# Altium project demo_dermis_main_testboard.PrjPcb (part 1 of 2)
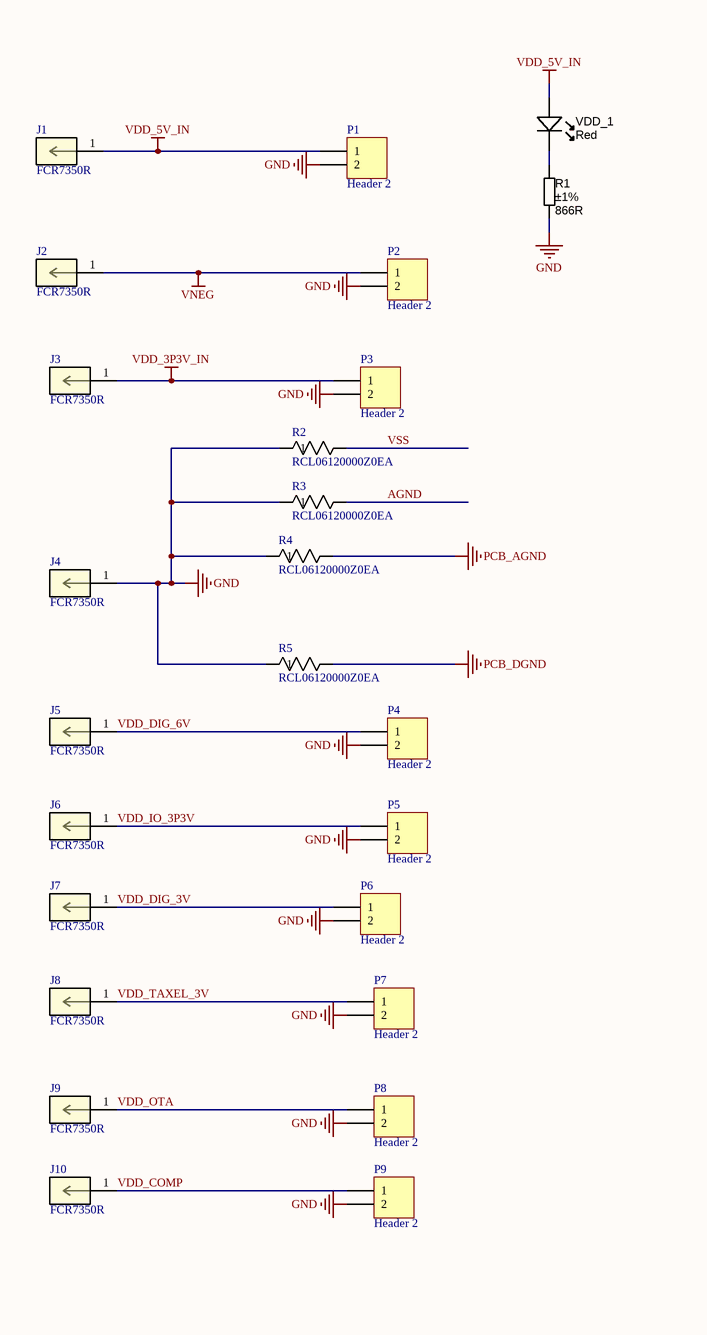
[diagram p0: demo_dermis_main_testboard.SchDoc, top left]
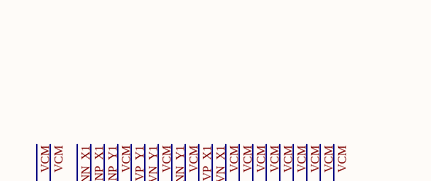
[diagram p1: demo_dermis_main_testboard.SchDoc, top right]
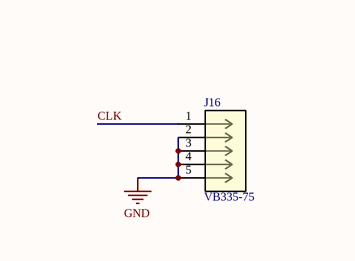
[diagram p2: demo_dermis_main_testboard.SchDoc, bottom middle]
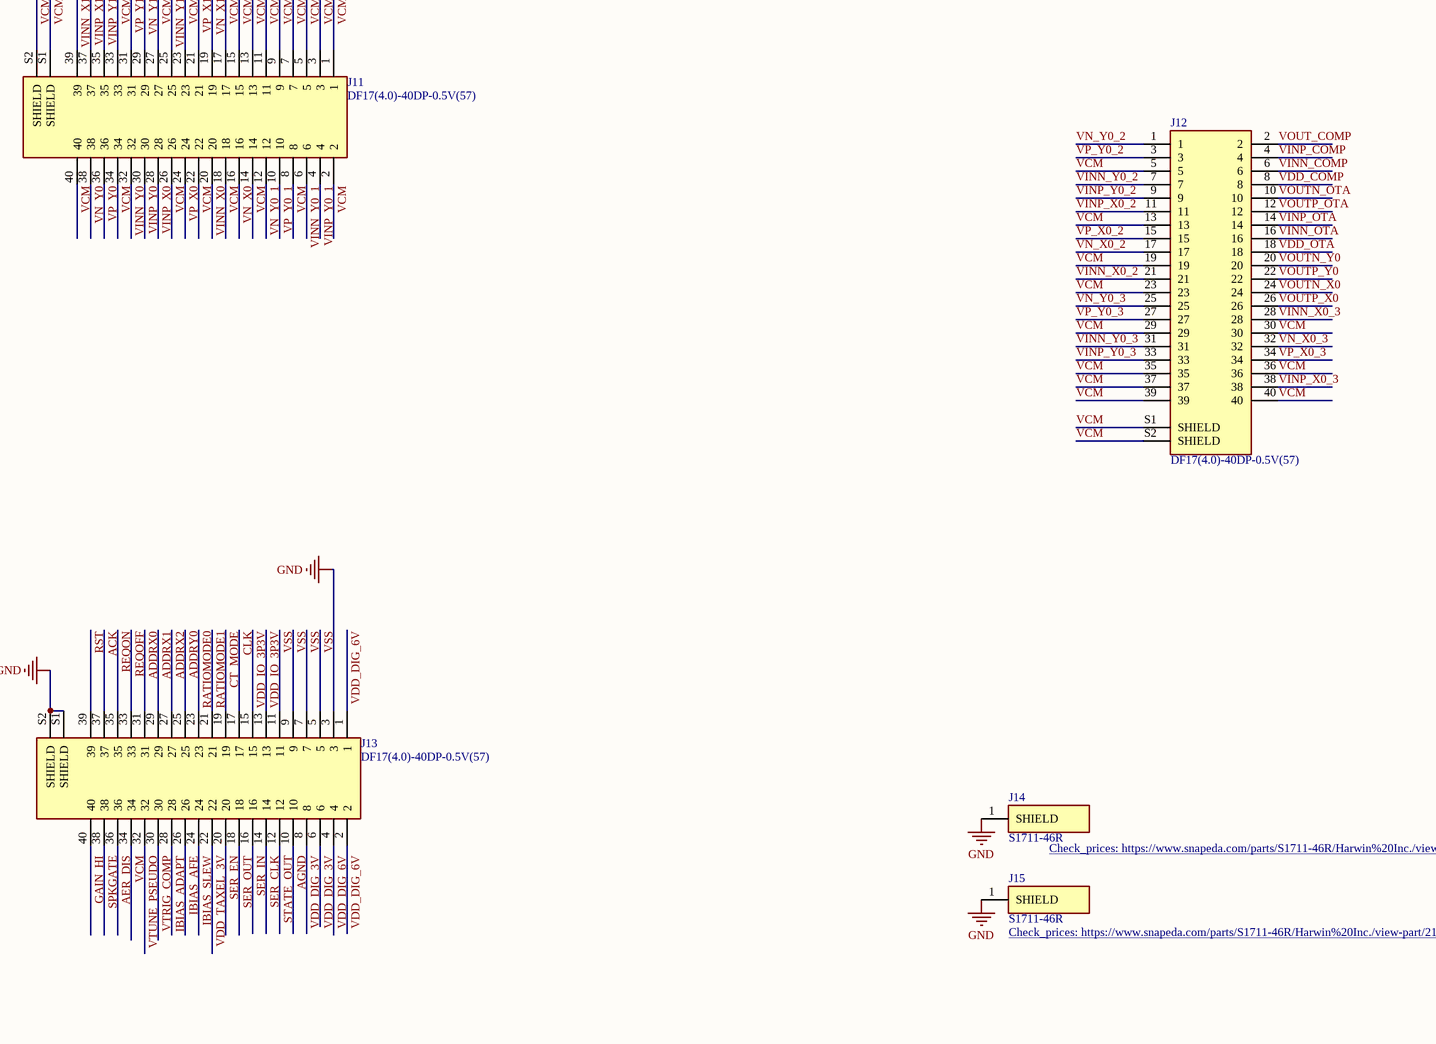
[diagram p3: demo_dermis_main_testboard.SchDoc, bottom right]
6 sheets, 389 parts. Net scope: global (net labels, ports and power ports of the same name join across sheets).
Board file: demo_dermis_main_testboard.PcbDoc
Sheets:
  demo_dermis_main_testboard.SchDoc
  demo_dermis_main_testboard_ncd2400.SchDoc
  demo_dermis_main_testboard_ibias.SchDoc
  demo_dermis_main_testboard_inamps.SchDoc
  demo_dermis_main_testboard_dig.SchDoc
  demo_dermis_main_testboard_back.SchDoc

## Sheet demo_dermis_main_testboard.SchDoc
size A0

### Parts
J1  FCR7350R  [CONN1_FCR7350R_CLF]
J2  FCR7350R  [CONN1_FCR7350R_CLF]
J3  FCR7350R  [CONN1_FCR7350R_CLF]
J4  FCR7350R  [CONN1_FCR7350R_CLF]
J5  FCR7350R  [CONN1_FCR7350R_CLF]
J6  FCR7350R  [CONN1_FCR7350R_CLF]
J7  FCR7350R  [CONN1_FCR7350R_CLF]
J8  FCR7350R  [CONN1_FCR7350R_CLF]
J9  FCR7350R  [CONN1_FCR7350R_CLF]
J10  FCR7350R  [CONN1_FCR7350R_CLF]
J11  DF17(4.0)-40DP-0.5V(57)  [HRS_DF17(4.0)-40DP-0.5V(57)]
J12  DF17(4.0)-40DP-0.5V(57)  [HRS_DF17(4.0)-40DP-0.5V(57)]
J13  DF17(4.0)-40DP-0.5V(57)  [HRS_DF17(4.0)-40DP-0.5V(57)]
J14  S1711-46R  [HARWIN_S1711-46R]
J15  S1711-46R  [HARWIN_S1711-46R]
J16  VB335-75  [CONN5_VB335_CIN]
P1  Header 2  [HDR1X2]
P2  Header 2  [HDR1X2]
P3  Header 2  [HDR1X2]
P4  Header 2  [HDR1X2]
P5  Header 2  [HDR1X2]
P6  Header 2  [HDR1X2]
P7  Header 2  [HDR1X2]
P8  Header 2  [HDR1X2]
P9  Header 2  [HDR1X2]
R1  value 866R  Tolerance: ±1%  [RESC1608N]  (hidden comment: Thick Film)
R2  RCL06120000Z0EA  [RCL0612_VIS]
R3  RCL06120000Z0EA  [RCL0612_VIS]
R4  RCL06120000Z0EA  [RCL0612_VIS]
R5  RCL06120000Z0EA  [RCL0612_VIS]
VDD_1  Red  [LED-0603-RED]

### Nets
AGND: J13.10 R3.2
GND: J4.1 J13.3 J13.S1(SHIELD) J13.S2(SHIELD) J14.1(SHIELD) J15.1(SHIELD) J16.2 J16.3 J16.4 J16.5 P1.2 P2.2 P3.2 P4.2 P5.2 P6.2 P7.2 P8.2 P9.2 R1.2 R2.1 R3.1 R4.1 R5.1
PCB_AGND: R4.2
PCB_DGND: R5.2
VDD_3P3V_IN: J3.1 P3.1
VDD_5V_IN: J1.1 P1.1 VDD_1.A
VNEG: J2.1 P2.1
ACK: J13.37
ADDRX0: J13.31
ADDRX1: J13.29
ADDRX2: J13.27
ADDRY0: J13.25
AER_DIS: J13.36
CLK: J13.17 J16.1
CT_MODE: J13.19
GAIN_HI: J13.40
IBIAS_ADAPT: J13.28
IBIAS_AFE: J13.26
IBIAS_SLEW: J13.24
RATIOMODE0: J13.23
RATIOMODE1: J13.21
REQOFF: J13.33
REQON: J13.35
RST: J13.39
SER_CLK: J13.14
SER_EN: J13.20
SER_IN: J13.16
SER_OUT: J13.18
SPKGATE: J13.38
STATE_OUT: J13.12
VCM: J11.1 J11.2 J11.3 J11.5 J11.7 J11.8 J11.9 J11.11 J11.13 J11.14 J11.15 J11.17 J11.18 J11.22 J11.23 J11.26 J11.27 J11.33 J11.34 J11.40 J11.S1(SHIELD) J11.S2(SHIELD) J12.5 J12.13 J12.19 J12.23 J12.29 J12.30 J12.35 J12.36 J12.37 J12.39 J12.40 J12.S1(SHIELD) J12.S2(SHIELD) J13.34
VDD_COMP: J10.1 J12.8 P9.1
VDD_DIG_3V: J7.1 J13.6 J13.8 P6.1
VDD_DIG_6V: J5.1 J13.1 J13.2 J13.4 P4.1
VDD_IO_3P3V: J6.1 J13.13 J13.15 P5.1
VDD_OTA: J9.1 J12.18 P8.1
VDD_TAXEL_3V: J8.1 J13.22 P7.1
VINN_COMP: J12.6
VINN_OTA: J12.16
VINN_X0: J11.20
VINN_X0_2: J12.21
VINN_X0_3: J12.28
VINN_X1: J11.39
VINN_Y0: J11.32
VINN_Y0_1: J11.6
VINN_Y0_2: J12.7
VINN_Y0_3: J12.31
VINN_Y1: J11.25
VINP_COMP: J12.4
VINP_OTA: J12.14
VINP_X0: J11.28
VINP_X0_2: J12.11
VINP_X0_3: J12.38
VINP_X1: J11.37
VINP_Y0: J11.30
VINP_Y0_1: J11.4
VINP_Y0_2: J12.9
VINP_Y0_3: J12.33
VINP_Y1: J11.35
VN_X0: J11.16
VN_X0_2: J12.17
VN_X0_3: J12.32
VN_X1: J11.19
VN_Y0: J11.38
VN_Y0_1: J11.12
VN_Y0_2: J12.1
VN_Y0_3: J12.25
VN_Y1: J11.29
VOUT_COMP: J12.2
VOUTN_OTA: J12.10
VOUTN_X0: J12.24
VOUTN_Y0: J12.20
VOUTP_OTA: J12.12
VOUTP_X0: J12.26
VOUTP_Y0: J12.22
VP_X0: J11.24
VP_X0_2: J12.15
VP_X0_3: J12.34
VP_X1: J11.21
VP_Y0: J11.36
VP_Y0_1: J11.10
VP_Y0_2: J12.3
VP_Y0_3: J12.27
VP_Y1: J11.31
VSS: J13.5 J13.7 J13.9 J13.11 R2.2
VTRIG_COMP: J13.30
VTUNE_PSEUDO: J13.32
NetR1_1: R1.1 VDD_1.K

### Notes on the sheet
- Title
- Size:
- Date:
- File:
- A0
- Number:
- Time:
- Revision:
- Sheet
- of

### Library data of the parts
J1-J10 = FCR7350R: No Description Available; Mfr_Name: Cliff; Copyright: Copyright (C) 2022 Ultra Librarian. All rights reserved.; Manufacturer_Part_Number: FCR7350R; RefDes: RefDes; Type: DEV
J11-J13 = DF17(4.0)-40DP-0.5V(57): PC Board, Headers & Receptacles, hdr, fit, series, mount, pos, Connectors and Adapters, connector, header, Connectors...; Availability: Unavailable; MP: DF17(4.0)-40DP-0.5V(57); Price: None; Package: None; Value: *
J14 J15 = S1711-46R: RFI SHIELD CLIP TIN SMD; MF: Harwin Inc.; Purchase-URL: https://pricing.snapeda.com/search/part/S1711-46R/?ref=eda; MP: S1711-46R; SnapEDA_Link: https://www.snapeda.com/parts/S1711-46R/Harwin%20Inc./view-part/2172610/?ref=snap; Price: None; Package: None; Value: *; Availability: Warning; Check_prices: https://www.snapeda.com/parts/S1711-46R/Harwin%20Inc./view-part/2172610/?ref=eda
J16 = VB335-75: No Description Available; Mfr_Name: Cinch Connectivity Solutions; Type: Coaxial Connectors(RF) Assemblies; RefDes: RefDes
P1-P9 = Header 2: Header, 2-Pin; LatestRevisionDate: 17-Jul-2002; LatestRevisionNote: Re-released for DXP Platform.; Publisher: Altium Limited
R1 = RES_866R_0603_1%_1: Resistor SMD chip 866 Ohm 0.1W 1% 0603; Ratings: 1/10W; Package / Case: 0603 (1608 Metric)
R2-R5 = RCL06120000Z0EA: No Description Available; Mfr_Name: Vishay
VDD_1 = LED_SMD_Red_0603_220mcd: LED 0603 SMD Hyper Red 630nm 220mcd 20mA; Manufacturer 1: Kingbright Corp; Manufacturer Part Number 1: APT1608SURCK; Ratings: 220 mcd; 630 nm; Voltage - Forward (Vf) Typ: 1.95V; Voltage - Forward (Vf) @ 10mA: 1.9V; Package / Case: 0603 (1608 metric); Material: AlGaInP on GaAs; Supplier 1: Digi-Key; Supplier Part Number 1: 754-1123-1-ND

## Sheet demo_dermis_main_testboard_ncd2400.SchDoc
size E
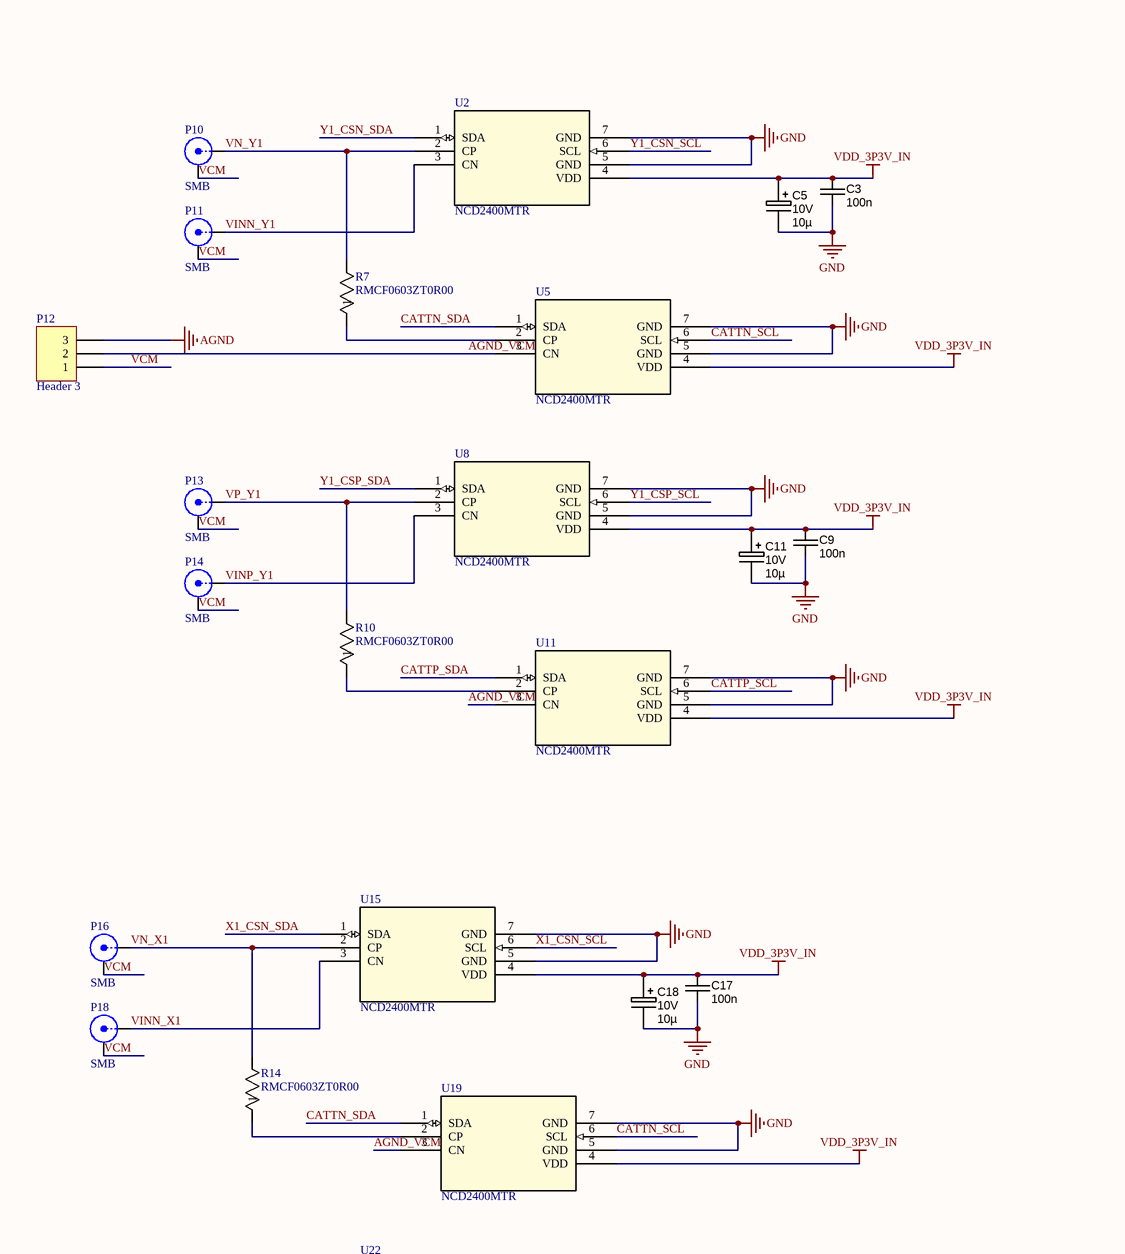
[diagram p4: demo_dermis_main_testboard_ncd2400.SchDoc, top left]
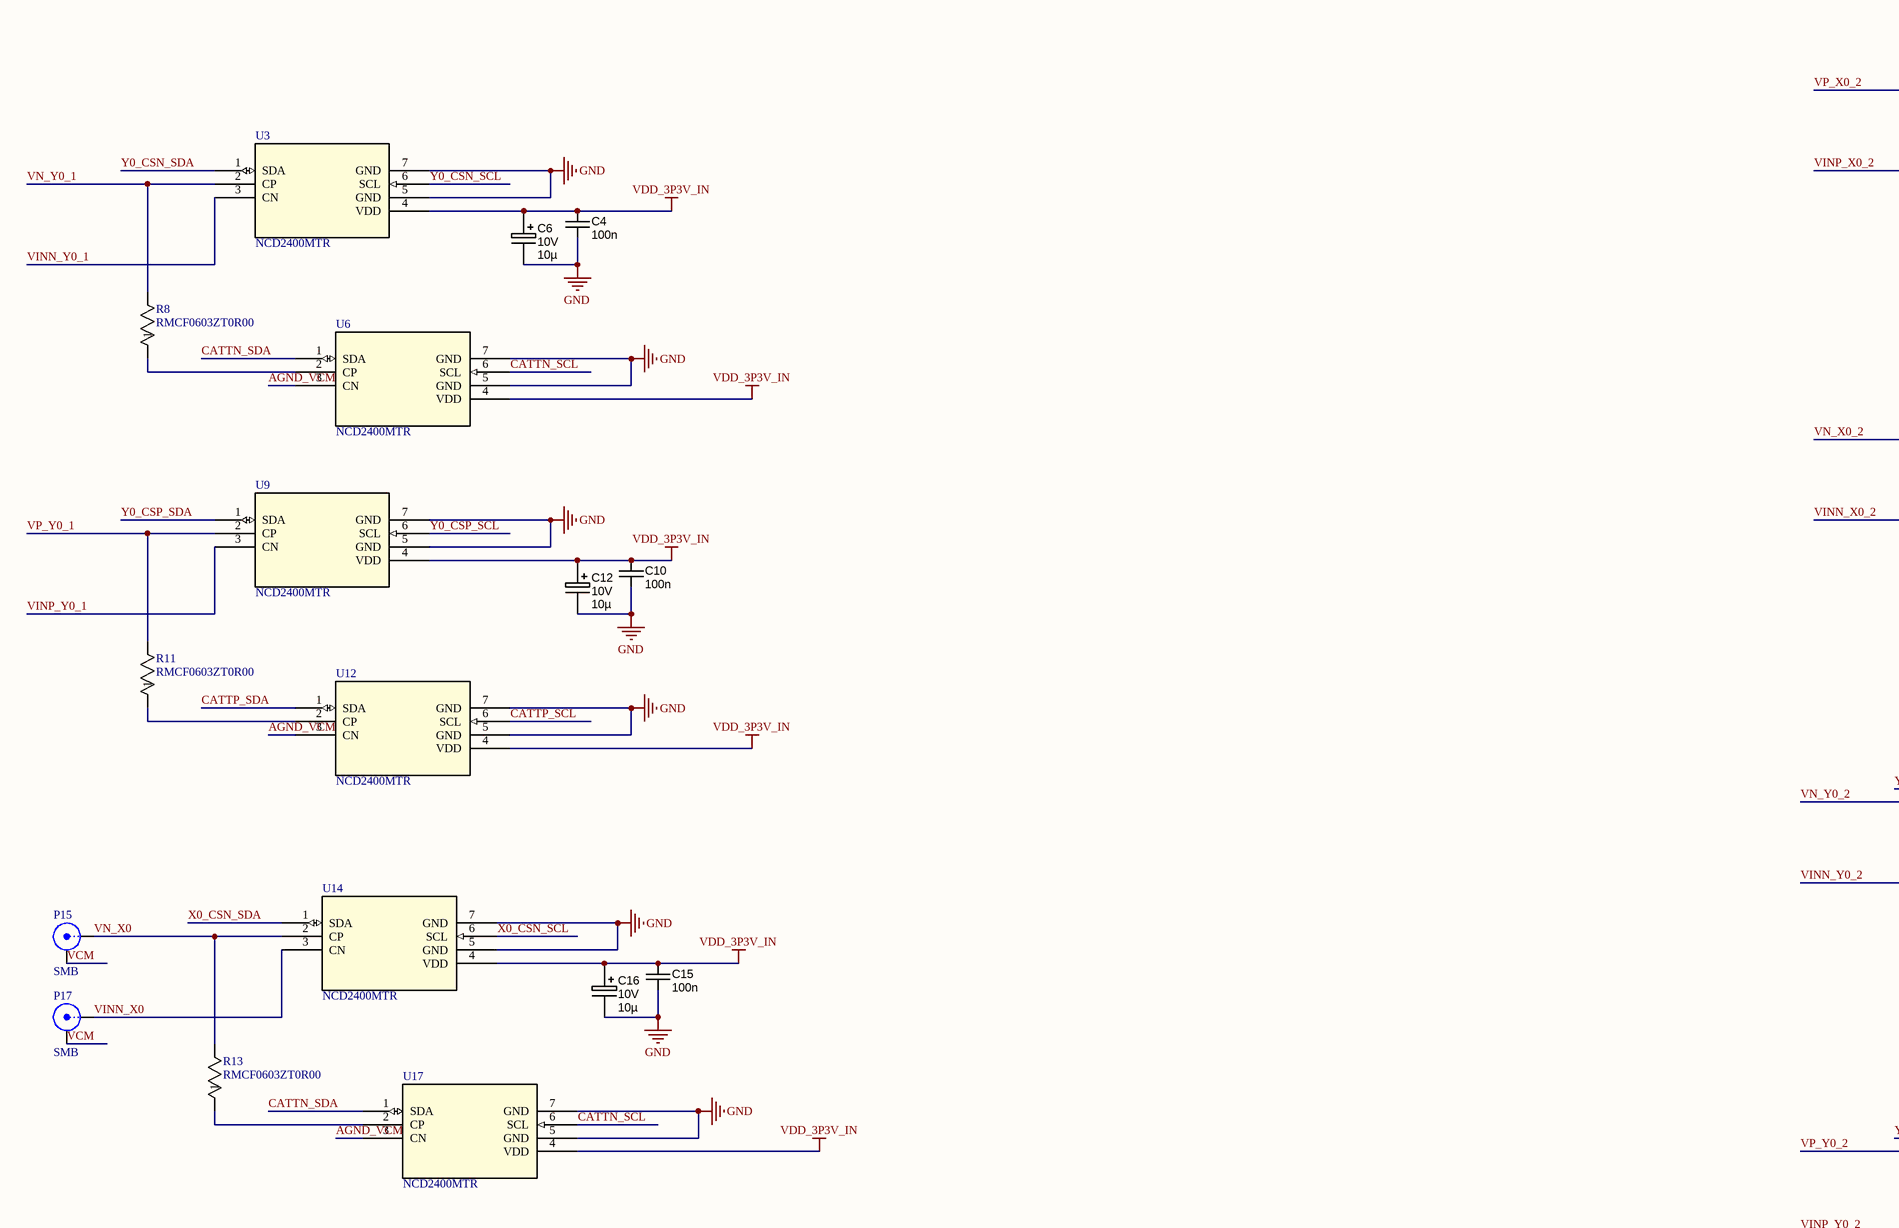
[diagram p5: demo_dermis_main_testboard_ncd2400.SchDoc, top middle]
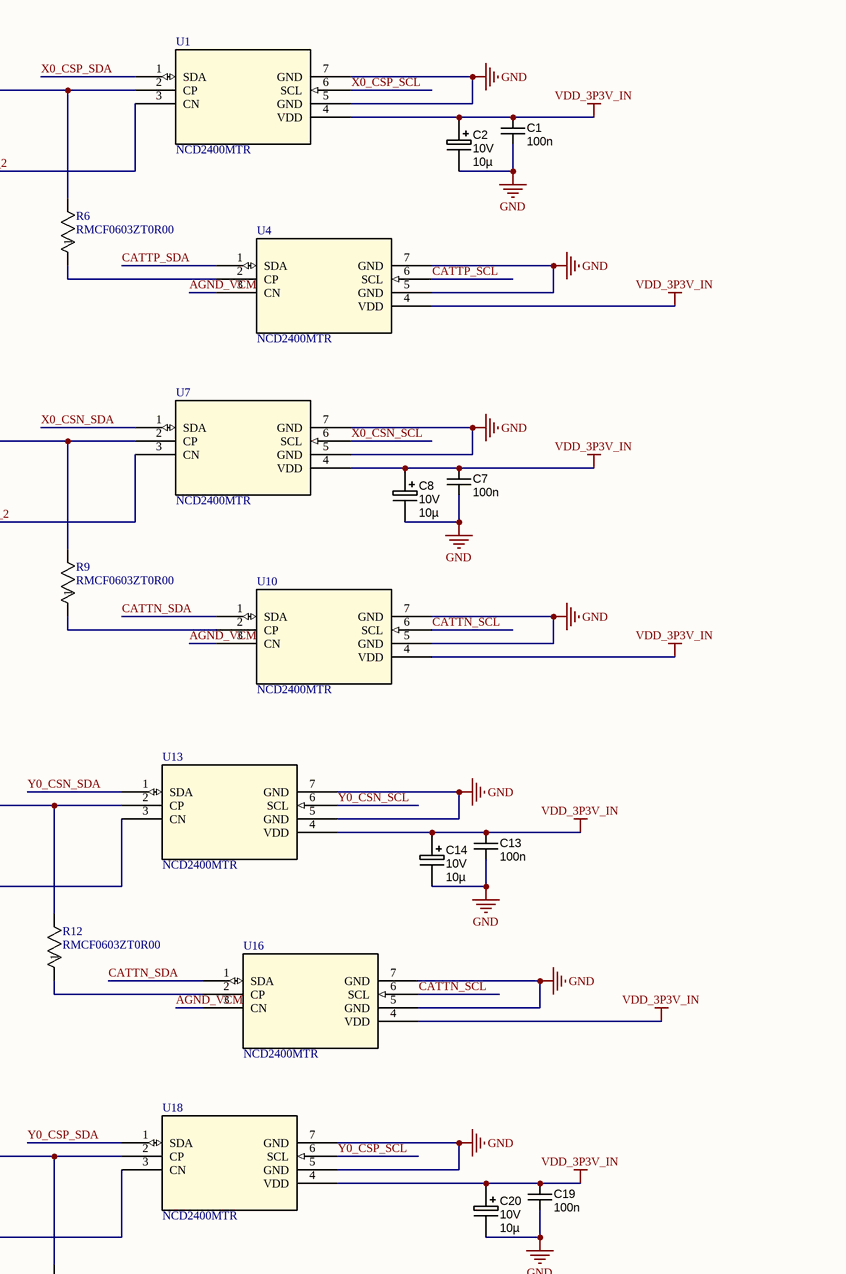
[diagram p6: demo_dermis_main_testboard_ncd2400.SchDoc, top right]
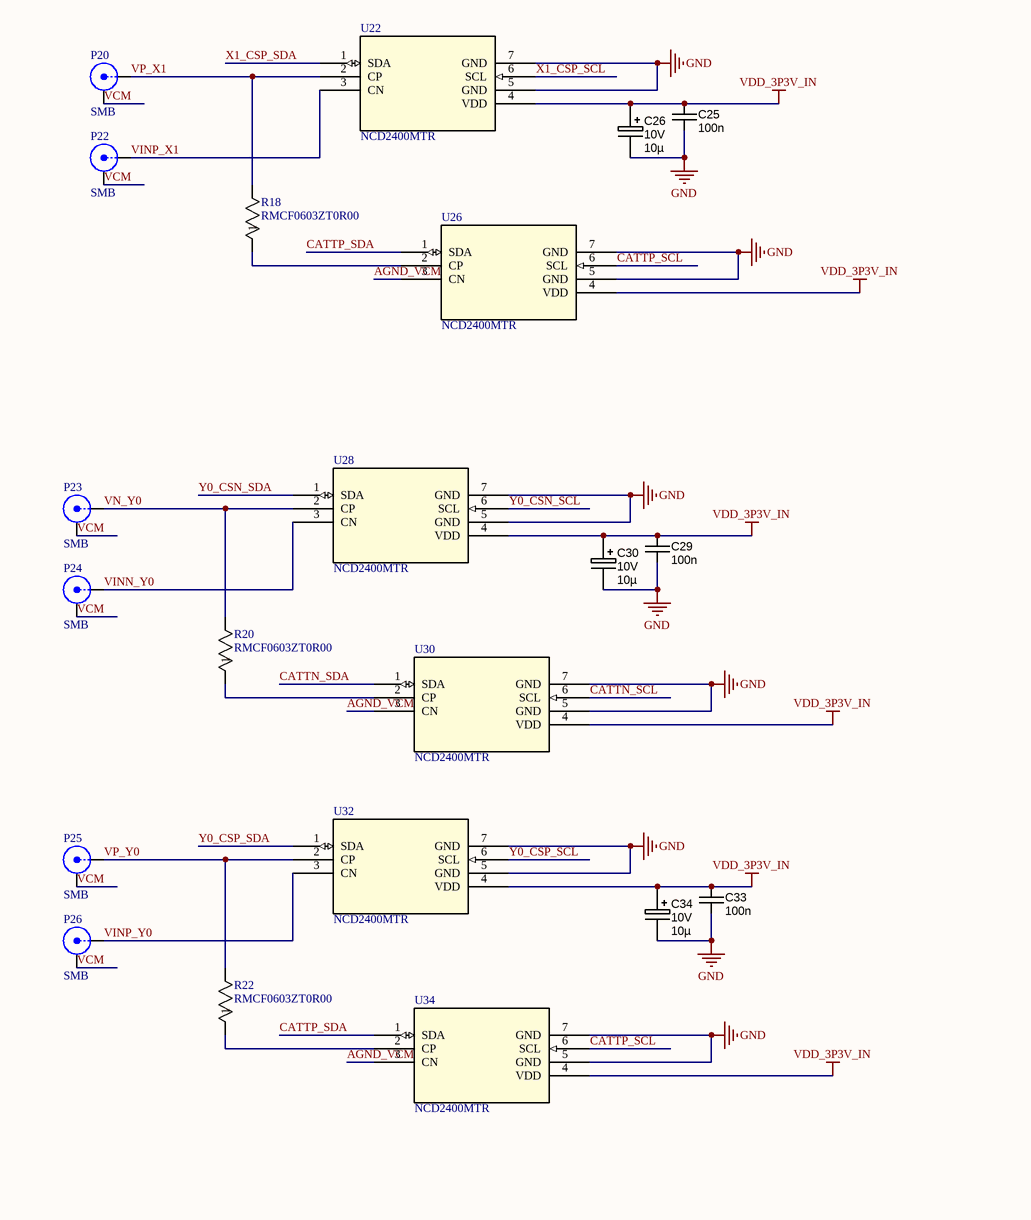
[diagram p7: demo_dermis_main_testboard_ncd2400.SchDoc, bottom left]
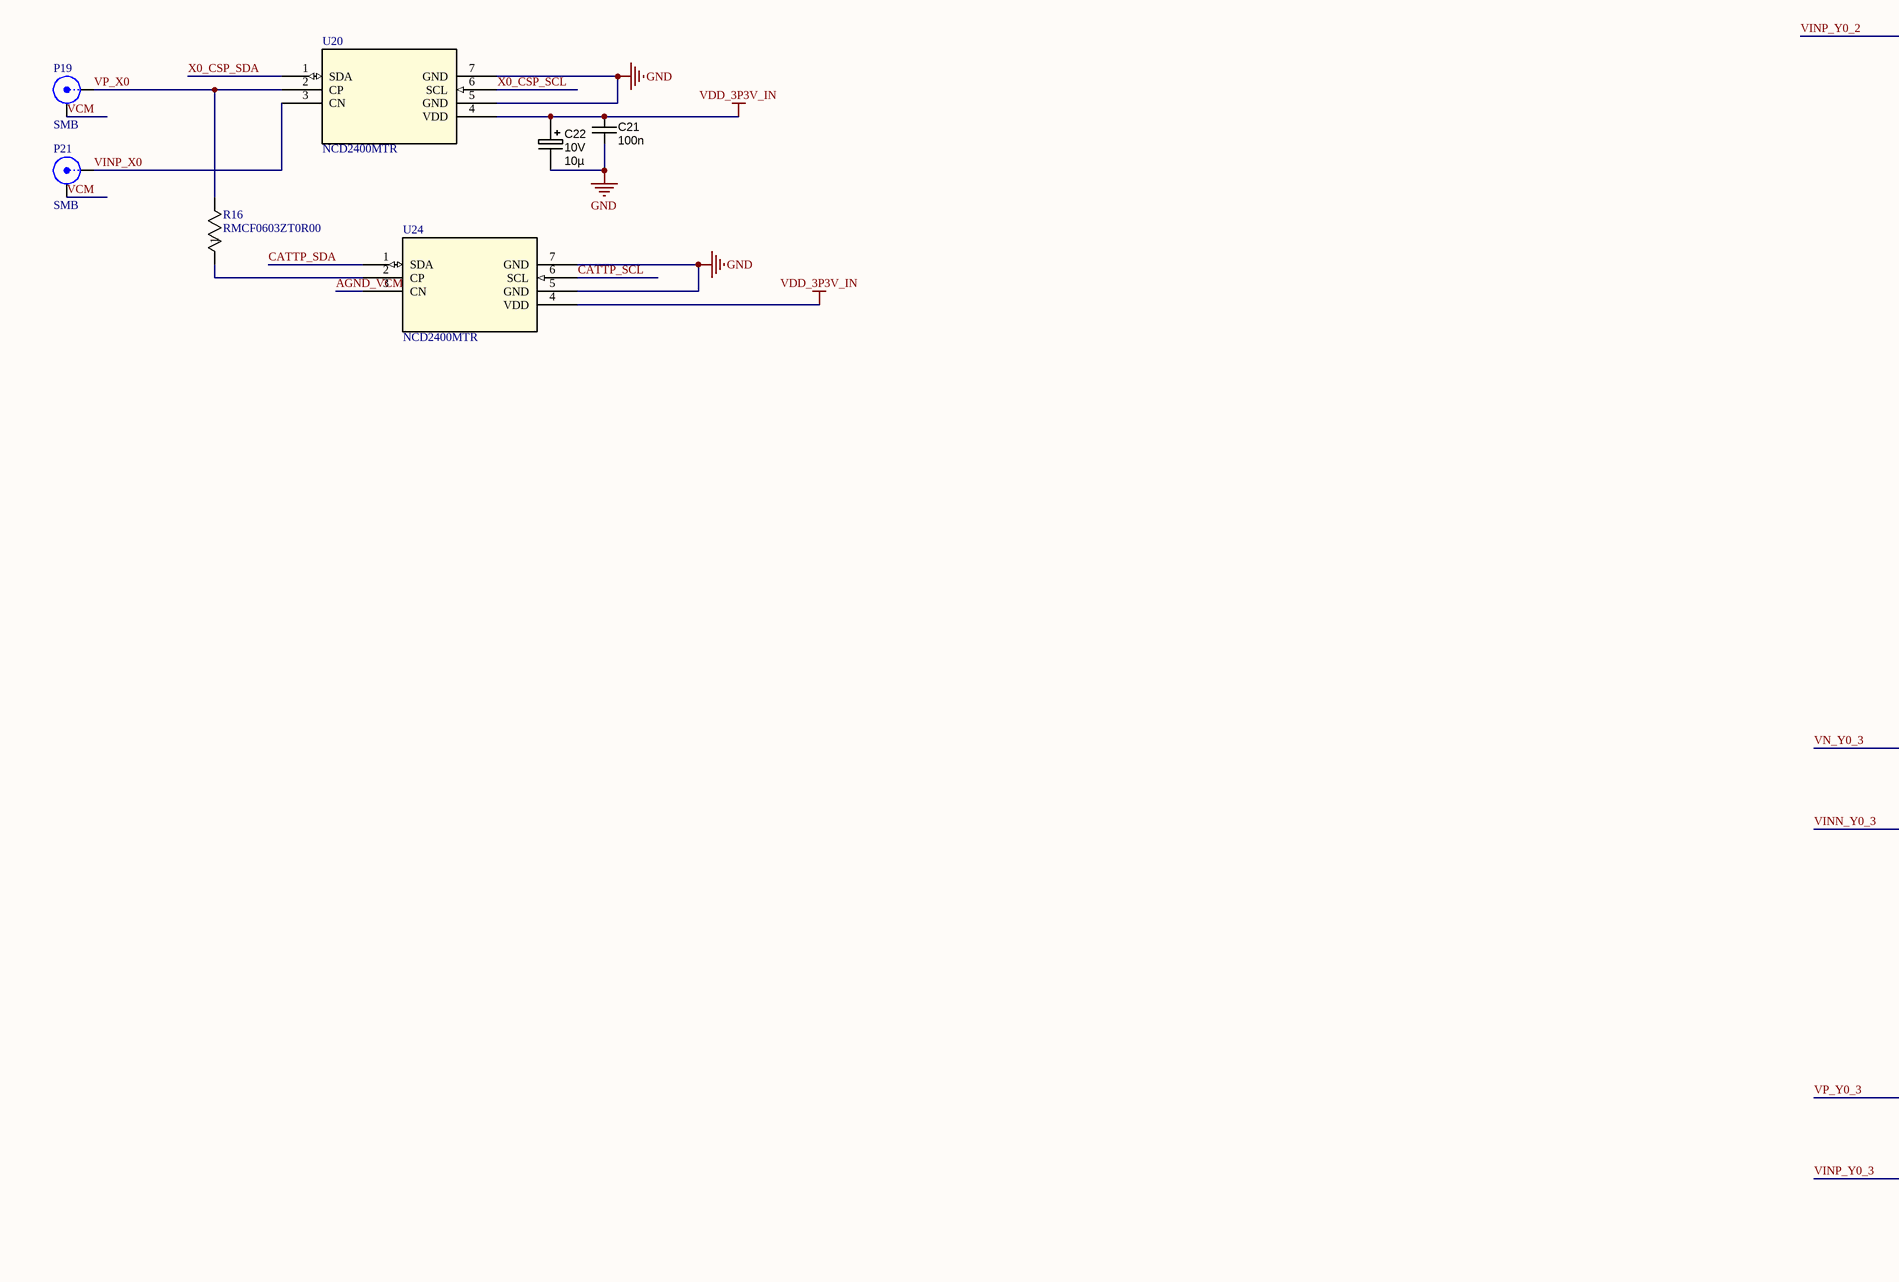
[diagram p8: demo_dermis_main_testboard_ncd2400.SchDoc, bottom middle]
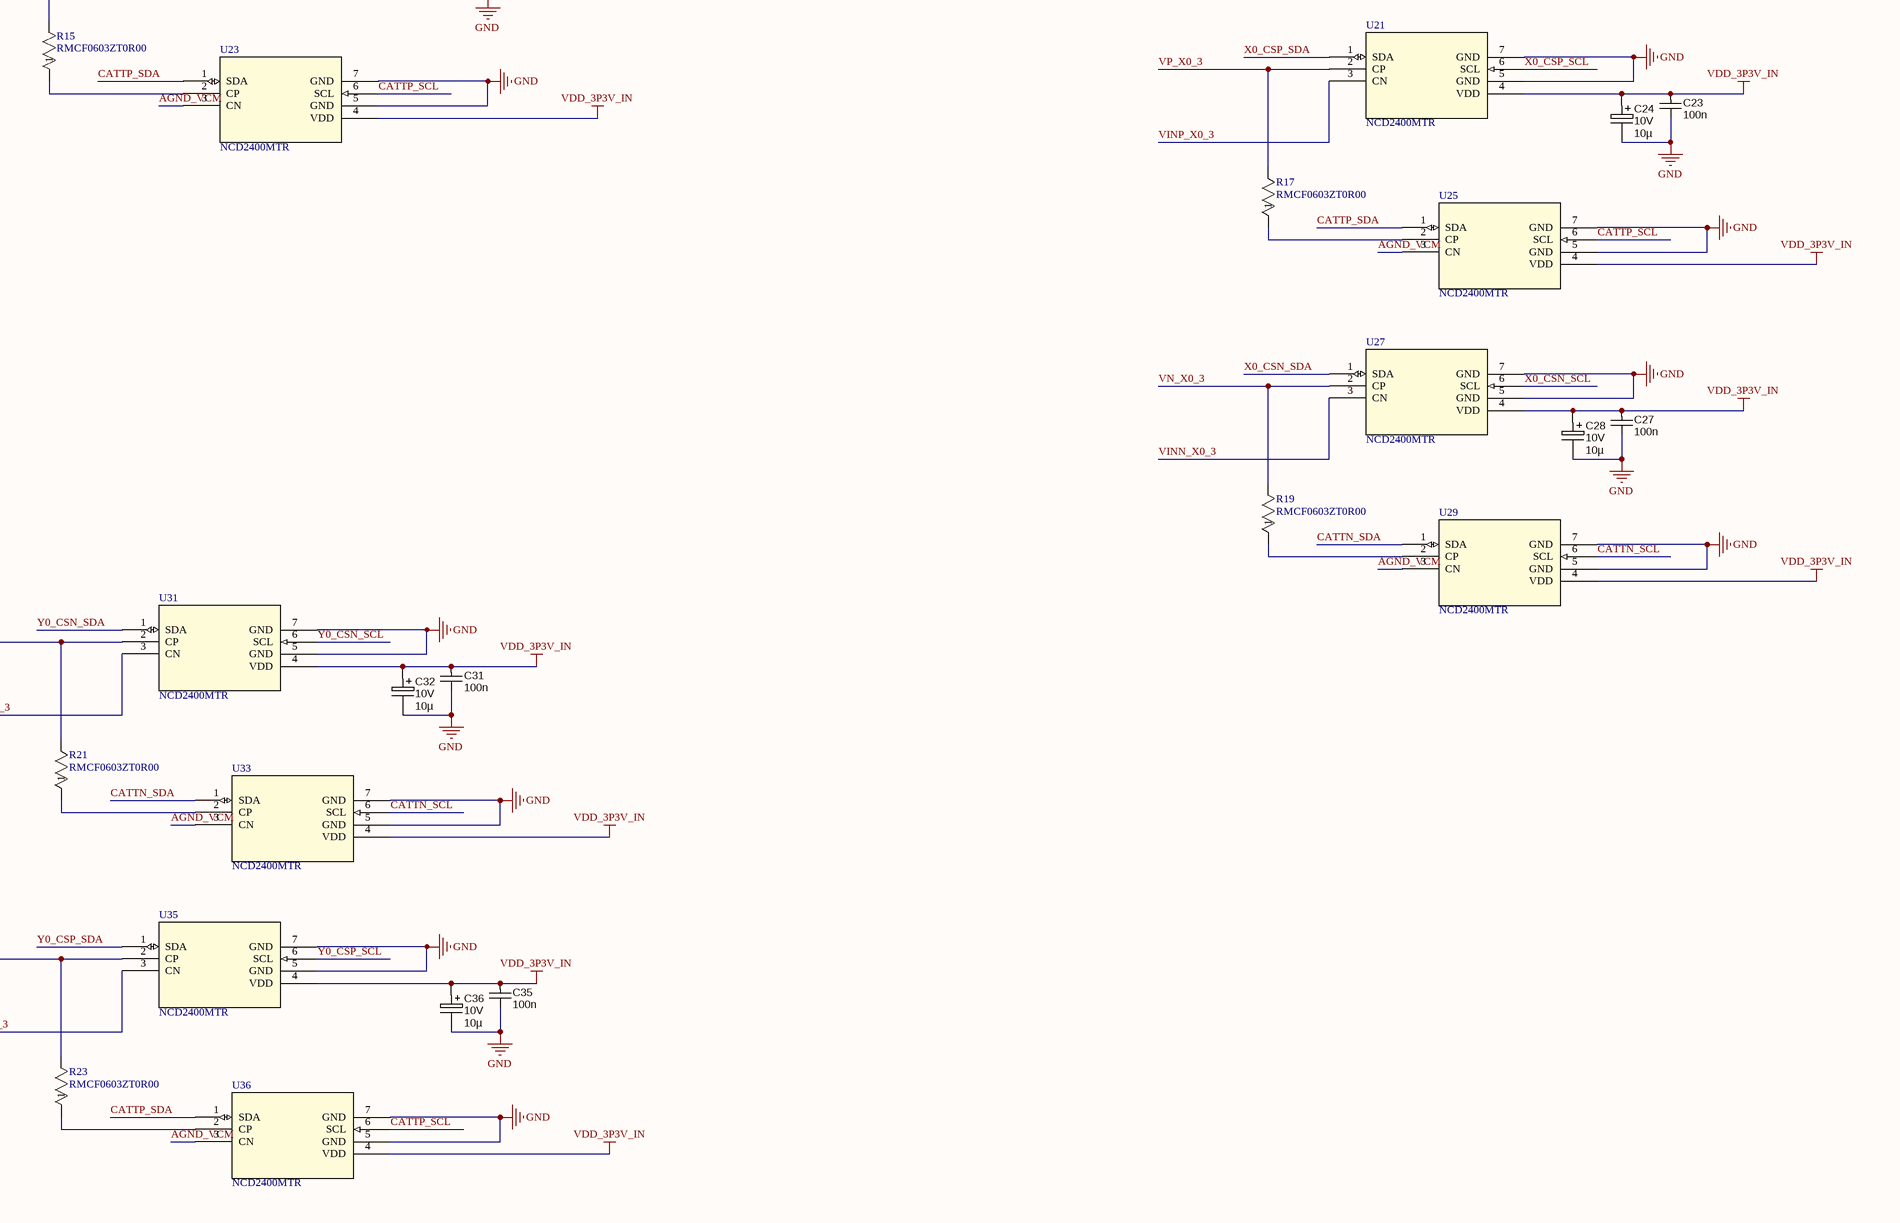
[diagram p9: demo_dermis_main_testboard_ncd2400.SchDoc, bottom right]

### Parts
C1  value 100n  [CAPC1608N]  (hidden comment: approved sub OK)
C2  Ratings: 10V  [CAPMP2012X150USR]  (hidden comment: 10µ)
C3  value 100n  [CAPC1608N]  (hidden comment: approved sub OK)
C4  value 100n  [CAPC1608N]  (hidden comment: approved sub OK)
C5  Ratings: 10V  [CAPMP2012X150USR]  (hidden comment: 10µ)
C6  Ratings: 10V  [CAPMP2012X150USR]  (hidden comment: 10µ)
C7  value 100n  [CAPC1608N]  (hidden comment: approved sub OK)
C8  Ratings: 10V  [CAPMP2012X150USR]  (hidden comment: 10µ)
C9  value 100n  [CAPC1608N]  (hidden comment: approved sub OK)
C10  value 100n  [CAPC1608N]  (hidden comment: approved sub OK)
C11  Ratings: 10V  [CAPMP2012X150USR]  (hidden comment: 10µ)
C12  Ratings: 10V  [CAPMP2012X150USR]  (hidden comment: 10µ)
C13  value 100n  [CAPC1608N]  (hidden comment: approved sub OK)
C14  Ratings: 10V  [CAPMP2012X150USR]  (hidden comment: 10µ)
C15  value 100n  [CAPC1608N]  (hidden comment: approved sub OK)
C16  Ratings: 10V  [CAPMP2012X150USR]  (hidden comment: 10µ)
C17  value 100n  [CAPC1608N]  (hidden comment: approved sub OK)
C18  Ratings: 10V  [CAPMP2012X150USR]  (hidden comment: 10µ)
C19  value 100n  [CAPC1608N]  (hidden comment: approved sub OK)
C20  Ratings: 10V  [CAPMP2012X150USR]  (hidden comment: 10µ)
C21  value 100n  [CAPC1608N]  (hidden comment: approved sub OK)
C22  Ratings: 10V  [CAPMP2012X150USR]  (hidden comment: 10µ)
C23  value 100n  [CAPC1608N]  (hidden comment: approved sub OK)
C24  Ratings: 10V  [CAPMP2012X150USR]  (hidden comment: 10µ)
C25  value 100n  [CAPC1608N]  (hidden comment: approved sub OK)
C26  Ratings: 10V  [CAPMP2012X150USR]  (hidden comment: 10µ)
C27  value 100n  [CAPC1608N]  (hidden comment: approved sub OK)
C28  Ratings: 10V  [CAPMP2012X150USR]  (hidden comment: 10µ)
C29  value 100n  [CAPC1608N]  (hidden comment: approved sub OK)
C30  Ratings: 10V  [CAPMP2012X150USR]  (hidden comment: 10µ)
C31  value 100n  [CAPC1608N]  (hidden comment: approved sub OK)
C32  Ratings: 10V  [CAPMP2012X150USR]  (hidden comment: 10µ)
C33  value 100n  [CAPC1608N]  (hidden comment: approved sub OK)
C34  Ratings: 10V  [CAPMP2012X150USR]  (hidden comment: 10µ)
C35  value 100n  [CAPC1608N]  (hidden comment: approved sub OK)
C36  Ratings: 10V  [CAPMP2012X150USR]  (hidden comment: 10µ)
P10  SMB  [SMB_V-RJ45]
P11  SMB  [SMB_V-RJ45]
P12  Header 3  [HDR1X3]
P13  SMB  [SMB_V-RJ45]
P14  SMB  [SMB_V-RJ45]
P15  SMB  [SMB_V-RJ45]
P16  SMB  [SMB_V-RJ45]
P17  SMB  [SMB_V-RJ45]
P18  SMB  [SMB_V-RJ45]
P19  SMB  [SMB_V-RJ45]
P20  SMB  [SMB_V-RJ45]
P21  SMB  [SMB_V-RJ45]
P22  SMB  [SMB_V-RJ45]
P23  SMB  [SMB_V-RJ45]
P24  SMB  [SMB_V-RJ45]
P25  SMB  [SMB_V-RJ45]
P26  SMB  [SMB_V-RJ45]
R6  RMCF0603ZT0R00  [STA_RMCF0603_STP]
R7  RMCF0603ZT0R00  [STA_RMCF0603_STP]
R8  RMCF0603ZT0R00  [STA_RMCF0603_STP]
R9  RMCF0603ZT0R00  [STA_RMCF0603_STP]
R10  RMCF0603ZT0R00  [STA_RMCF0603_STP]
R11  RMCF0603ZT0R00  [STA_RMCF0603_STP]
R12  RMCF0603ZT0R00  [STA_RMCF0603_STP]
R13  RMCF0603ZT0R00  [STA_RMCF0603_STP]
R14  RMCF0603ZT0R00  [STA_RMCF0603_STP]
R15  RMCF0603ZT0R00  [STA_RMCF0603_STP]
R16  RMCF0603ZT0R00  [STA_RMCF0603_STP]
R17  RMCF0603ZT0R00  [STA_RMCF0603_STP]
R18  RMCF0603ZT0R00  [STA_RMCF0603_STP]
R19  RMCF0603ZT0R00  [STA_RMCF0603_STP]
R20  RMCF0603ZT0R00  [STA_RMCF0603_STP]
R21  RMCF0603ZT0R00  [STA_RMCF0603_STP]
R22  RMCF0603ZT0R00  [STA_RMCF0603_STP]
R23  RMCF0603ZT0R00  [STA_RMCF0603_STP]
U1  NCD2400MTR  [DFN-6_IXY]
U2  NCD2400MTR  [DFN-6_IXY]
U3  NCD2400MTR  [DFN-6_IXY]
U4  NCD2400MTR  [DFN-6_IXY]
U5  NCD2400MTR  [DFN-6_IXY]
U6  NCD2400MTR  [DFN-6_IXY]
U7  NCD2400MTR  [DFN-6_IXY]
U8  NCD2400MTR  [DFN-6_IXY]
U9  NCD2400MTR  [DFN-6_IXY]
U10  NCD2400MTR  [DFN-6_IXY]
U11  NCD2400MTR  [DFN-6_IXY]
U12  NCD2400MTR  [DFN-6_IXY]
U13  NCD2400MTR  [DFN-6_IXY]
U14  NCD2400MTR  [DFN-6_IXY]
U15  NCD2400MTR  [DFN-6_IXY]
U16  NCD2400MTR  [DFN-6_IXY]
U17  NCD2400MTR  [DFN-6_IXY]
U18  NCD2400MTR  [DFN-6_IXY]
U19  NCD2400MTR  [DFN-6_IXY]
U20  NCD2400MTR  [DFN-6_IXY]
U21  NCD2400MTR  [DFN-6_IXY]
U22  NCD2400MTR  [DFN-6_IXY]
U23  NCD2400MTR  [DFN-6_IXY]
U24  NCD2400MTR  [DFN-6_IXY]
U25  NCD2400MTR  [DFN-6_IXY]
U26  NCD2400MTR  [DFN-6_IXY]
U27  NCD2400MTR  [DFN-6_IXY]
U28  NCD2400MTR  [DFN-6_IXY]
U29  NCD2400MTR  [DFN-6_IXY]
U30  NCD2400MTR  [DFN-6_IXY]
U31  NCD2400MTR  [DFN-6_IXY]
U32  NCD2400MTR  [DFN-6_IXY]
U33  NCD2400MTR  [DFN-6_IXY]
U34  NCD2400MTR  [DFN-6_IXY]
U35  NCD2400MTR  [DFN-6_IXY]
U36  NCD2400MTR  [DFN-6_IXY]

### Nets
AGND: P12.3
GND: C1.2 C2.2 C3.2 C4.2 C5.2 C6.2 C7.2 C8.2 C9.2 C10.2 C11.2 C12.2 C13.2 C14.2 C15.2 C16.2 C17.2 C18.2 C19.2 C20.2 C21.2 C22.2 C23.2 C24.2 C25.2 C26.2 C27.2 C28.2 C29.2 C30.2 C31.2 C32.2 C33.2 C34.2 C35.2 C36.2 U1.5(GND) U1.7(GND) U2.5(GND) U2.7(GND) U3.5(GND) U3.7(GND) U4.5(GND) U4.7(GND) U5.5(GND) U5.7(GND) U6.5(GND) U6.7(GND) U7.5(GND) U7.7(GND) U8.5(GND) U8.7(GND) U9.5(GND) U9.7(GND) U10.5(GND) U10.7(GND) U11.5(GND) U11.7(GND) U12.5(GND) U12.7(GND) U13.5(GND) U13.7(GND) U14.5(GND) U14.7(GND) U15.5(GND) U15.7(GND) U16.5(GND) U16.7(GND) U17.5(GND) U17.7(GND) U18.5(GND) U18.7(GND) U19.5(GND) U19.7(GND) U20.5(GND) U20.7(GND) U21.5(GND) U21.7(GND) U22.5(GND) U22.7(GND) U23.5(GND) U23.7(GND) U24.5(GND) U24.7(GND) U25.5(GND) U25.7(GND) U26.5(GND) U26.7(GND) U27.5(GND) U27.7(GND) U28.5(GND) U28.7(GND) U29.5(GND) U29.7(GND) U30.5(GND) U30.7(GND) U31.5(GND) U31.7(GND) U32.5(GND) U32.7(GND) U33.5(GND) U33.7(GND) U34.5(GND) U34.7(GND) U35.5(GND) U35.7(GND) U36.5(GND) U36.7(GND)
VDD_3P3V_IN: C1.1 C2.1 C3.1 C4.1 C5.1 C6.1 C7.1 C8.1 C9.1 C10.1 C11.1 C12.1 C13.1 C14.1 C15.1 C16.1 C17.1 C18.1 C19.1 C20.1 C21.1 C22.1 C23.1 C24.1 C25.1 C26.1 C27.1 C28.1 C29.1 C30.1 C31.1 C32.1 C33.1 C34.1 C35.1 C36.1 U1.4(VDD) U2.4(VDD) U3.4(VDD) U4.4(VDD) U5.4(VDD) U6.4(VDD) U7.4(VDD) U8.4(VDD) U9.4(VDD) U10.4(VDD) U11.4(VDD) U12.4(VDD) U13.4(VDD) U14.4(VDD) U15.4(VDD) U16.4(VDD) U17.4(VDD) U18.4(VDD) U19.4(VDD) U20.4(VDD) U21.4(VDD) U22.4(VDD) U23.4(VDD) U24.4(VDD) U25.4(VDD) U26.4(VDD) U27.4(VDD) U28.4(VDD) U29.4(VDD) U30.4(VDD) U31.4(VDD) U32.4(VDD) U33.4(VDD) U34.4(VDD) U35.4(VDD) U36.4(VDD)
AGND_VCM: P12.2 U4.3(CN) U5.3(CN) U6.3(CN) U10.3(CN) U11.3(CN) U12.3(CN) U16.3(CN) U17.3(CN) U19.3(CN) U23.3(CN) U24.3(CN) U25.3(CN) U26.3(CN) U29.3(CN) U30.3(CN) U33.3(CN) U34.3(CN) U36.3(CN)
CATTN_SCL: U5.6(SCL) U6.6(SCL) U10.6(SCL) U16.6(SCL) U17.6(SCL) U19.6(SCL) U29.6(SCL) U30.6(SCL) U33.6(SCL)
CATTN_SDA: U5.1(SDA) U6.1(SDA) U10.1(SDA) U16.1(SDA) U17.1(SDA) U19.1(SDA) U29.1(SDA) U30.1(SDA) U33.1(SDA)
CATTP_SCL: U4.6(SCL) U11.6(SCL) U12.6(SCL) U23.6(SCL) U24.6(SCL) U25.6(SCL) U26.6(SCL) U34.6(SCL) U36.6(SCL)
CATTP_SDA: U4.1(SDA) U11.1(SDA) U12.1(SDA) U23.1(SDA) U24.1(SDA) U25.1(SDA) U26.1(SDA) U34.1(SDA) U36.1(SDA)
VCM: P10.2(Y) P11.2(Y) P12.1 P13.2(Y) P14.2(Y) P15.2(Y) P16.2(Y) P17.2(Y) P18.2(Y) P19.2(Y) P20.2(Y) P21.2(Y) P22.2(Y) P23.2(Y) P24.2(Y) P25.2(Y) P26.2(Y)
VINN_X0: P17.1(X) U14.3(CN)
VINN_X0_2: U7.3(CN)
VINN_X0_3: U27.3(CN)
VINN_X1: P18.1(X) U15.3(CN)
VINN_Y0: P24.1(X) U28.3(CN)
VINN_Y0_1: U3.3(CN)
VINN_Y0_2: U13.3(CN)
VINN_Y0_3: U31.3(CN)
VINN_Y1: P11.1(X) U2.3(CN)
VINP_X0: P21.1(X) U20.3(CN)
VINP_X0_2: U1.3(CN)
VINP_X0_3: U21.3(CN)
VINP_X1: P22.1(X) U22.3(CN)
VINP_Y0: P26.1(X) U32.3(CN)
VINP_Y0_1: U9.3(CN)
VINP_Y0_2: U18.3(CN)
VINP_Y0_3: U35.3(CN)
VINP_Y1: P14.1(X) U8.3(CN)
VN_X0: P15.1(X) R13.2 U14.2(CP)
VN_X0_2: R9.2 U7.2(CP)
VN_X0_3: R19.2 U27.2(CP)
VN_X1: P16.1(X) R14.2 U15.2(CP)
VN_Y0: P23.1(X) R20.2 U28.2(CP)
VN_Y0_1: R8.2 U3.2(CP)
VN_Y0_2: R12.2 U13.2(CP)
VN_Y0_3: R21.2 U31.2(CP)
VN_Y1: P10.1(X) R7.2 U2.2(CP)
VP_X0: P19.1(X) R16.2 U20.2(CP)
VP_X0_2: R6.2 U1.2(CP)
VP_X0_3: R17.2 U21.2(CP)
VP_X1: P20.1(X) R18.2 U22.2(CP)
VP_Y0: P25.1(X) R22.2 U32.2(CP)
VP_Y0_1: R11.2 U9.2(CP)
VP_Y0_2: R15.2 U18.2(CP)
VP_Y0_3: R23.2 U35.2(CP)
VP_Y1: P13.1(X) R10.2 U8.2(CP)
X0_CSN_SCL: U7.6(SCL) U14.6(SCL) U27.6(SCL)
X0_CSN_SDA: U7.1(SDA) U14.1(SDA) U27.1(SDA)
X0_CSP_SCL: U1.6(SCL) U20.6(SCL) U21.6(SCL)
X0_CSP_SDA: U1.1(SDA) U20.1(SDA) U21.1(SDA)
X1_CSN_SCL: U15.6(SCL)
X1_CSN_SDA: U15.1(SDA)
X1_CSP_SCL: U22.6(SCL)
X1_CSP_SDA: U22.1(SDA)
Y0_CSN_SCL: U3.6(SCL) U13.6(SCL) U28.6(SCL) U31.6(SCL)
Y0_CSN_SDA: U3.1(SDA) U13.1(SDA) U28.1(SDA) U31.1(SDA)
Y0_CSP_SCL: U9.6(SCL) U18.6(SCL) U32.6(SCL) U35.6(SCL)
Y0_CSP_SDA: U9.1(SDA) U18.1(SDA) U32.1(SDA) U35.1(SDA)
Y1_CSN_SCL: U2.6(SCL)
Y1_CSN_SDA: U2.1(SDA)
Y1_CSP_SCL: U8.6(SCL)
Y1_CSP_SDA: U8.1(SDA)
NetR6_1: R6.1 U4.2(CP)
NetR7_1: R7.1 U5.2(CP)
NetR8_1: R8.1 U6.2(CP)
NetR9_1: R9.1 U10.2(CP)
NetR10_1: R10.1 U11.2(CP)
NetR11_1: R11.1 U12.2(CP)
NetR12_1: R12.1 U16.2(CP)
NetR13_1: R13.1 U17.2(CP)
NetR14_1: R14.1 U19.2(CP)
NetR15_1: R15.1 U23.2(CP)
NetR16_1: R16.1 U24.2(CP)
NetR17_1: R17.1 U25.2(CP)
NetR18_1: R18.1 U26.2(CP)
NetR19_1: R19.1 U29.2(CP)
NetR20_1: R20.1 U30.2(CP)
NetR21_1: R21.1 U33.2(CP)
NetR22_1: R22.1 U34.2(CP)
NetR23_1: R23.1 U36.2(CP)

### Library data of the parts
C1 C3 C4 C7 C9 C10 C13 C15 C17 C19 C21 C23 C25 C27 C29 C31 C33 C35 = CAPC_100n_0603: Capacitor SMD Cer 100nF 10% 50V X7R 0603; Manufacturer 1: AVX Corporation; Manufacturer Part Number 1: 06035C104KAT2A; Ratings: 50V; X7R; Material: ceramic; Manufacturer 2: TDK Corporation; Manufacturer Part Number 2: C1608X7R1H104K; Package / Case: 0603 (1608 Metric); Tolerance: ±10%; Supplier 1: Digi-Key; Supplier Part Number 1: 478-5052-1-ND; ComponentLink1URL: http://www.avx.com/docs/Catalogs/cx7r.pdf; ComponentLink1Description: http://www.avx.com/docs/Catalogs/cx7r.pdf; Supplier 2: Digi-Key; Supplier Part Number 2: 445-1314-1-ND; ComponentLink2URL: http://product.tdk.com/capacitor/mlcc/en/documents/mlcc_commercial_general_en.pdf; ComponentLink2Description: http://product.tdk.com/capacitor/mlcc/en/documents/mlcc_commercial_general_en.pdf
C2 C5 C6 C8 C11 C12 C14 C16 C18 C20 C22 C24 C26 C28 C30 C32 C34 C36 = CAPT_10u_0805_10V: Capacitor SMD Tantalum 10uF 20% 10V 0805; Manufacturer 1: AVX Corporation; Manufacturer Part Number 1: TAJP106M010RNJ; Package / Case: 0805 (2012 metric); Tolerance: ±20%; Material: Tantalum; Supplier 1: Digi-Key; Supplier Part Number 1: 478-3281-1-ND; Value: 10µ
P10 P11 P13-P26 = SMB: SMB Straight Connector; LatestRevisionDate: 17-Jul-2002; LatestRevisionNote: Re-released for DXP Platform.; Publisher: Altium Limited
P12 = Header 3: Header, 3-Pin; LatestRevisionDate: 17-Jul-2002; LatestRevisionNote: Re-released for DXP Platform.; Publisher: Altium Limited
R6-R23 = RMCF0603ZT0R00: No Description Available; Mfr_Name: Stackpole International
U1-U36 = NCD2400MTR: No Description Available; Mfr_Name: Littelfuse / IXYS; RefDes: RefDes; Type: Type

## Sheet demo_dermis_main_testboard_ibias.SchDoc
size E
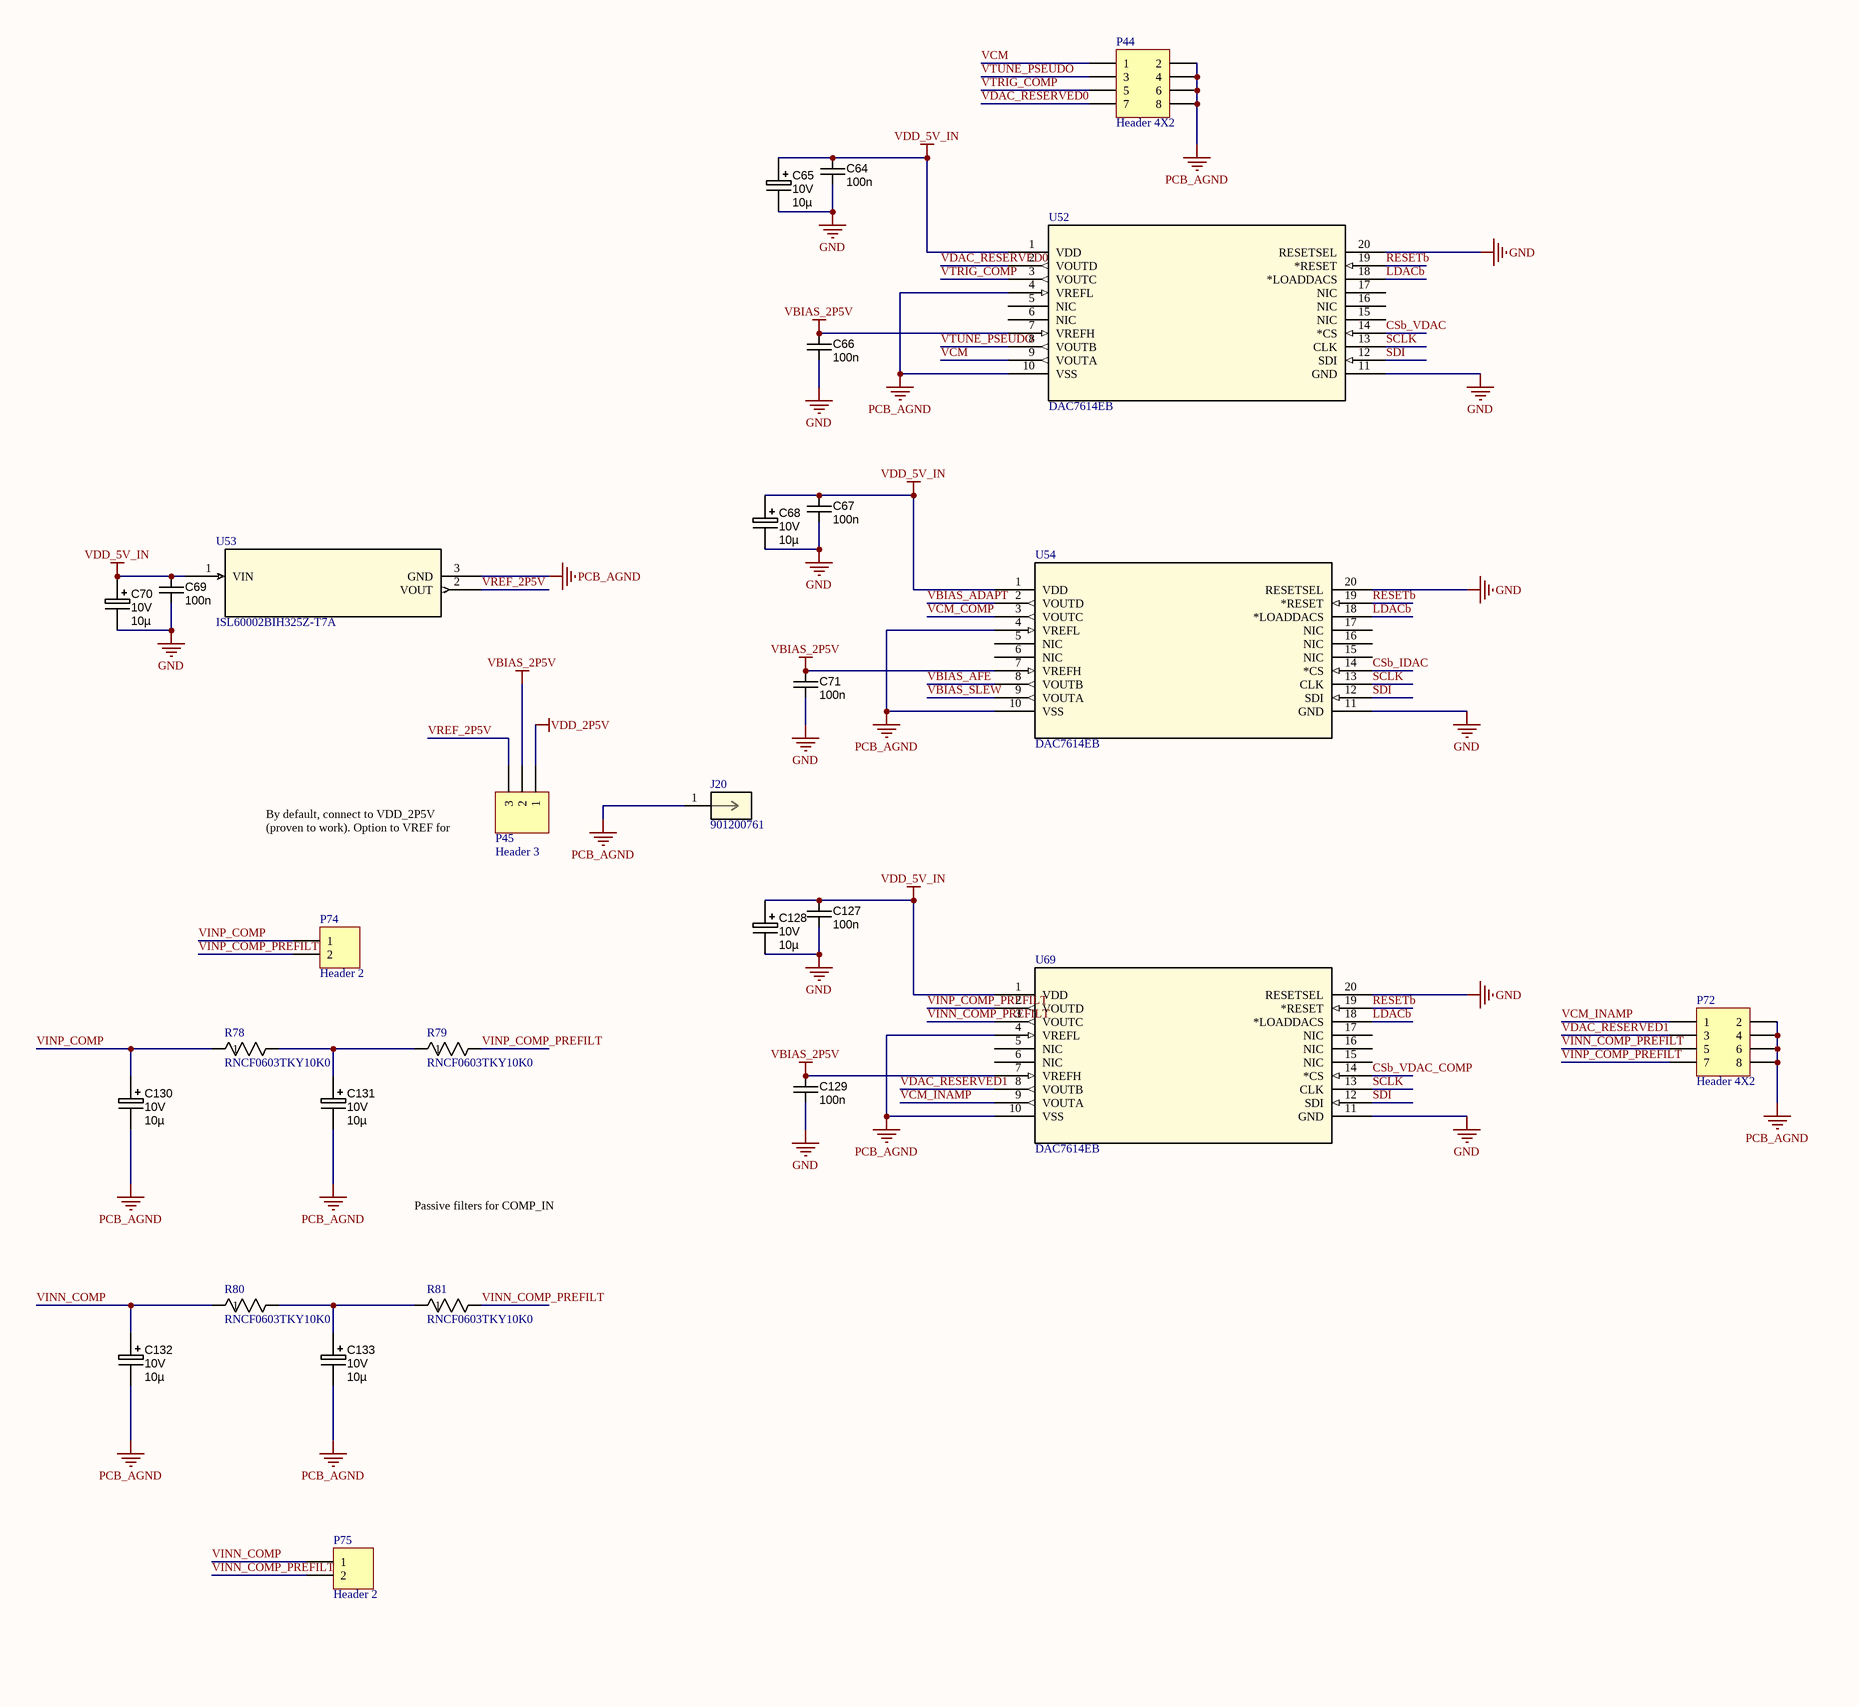
[diagram p10: demo_dermis_main_testboard_ibias.SchDoc, top]
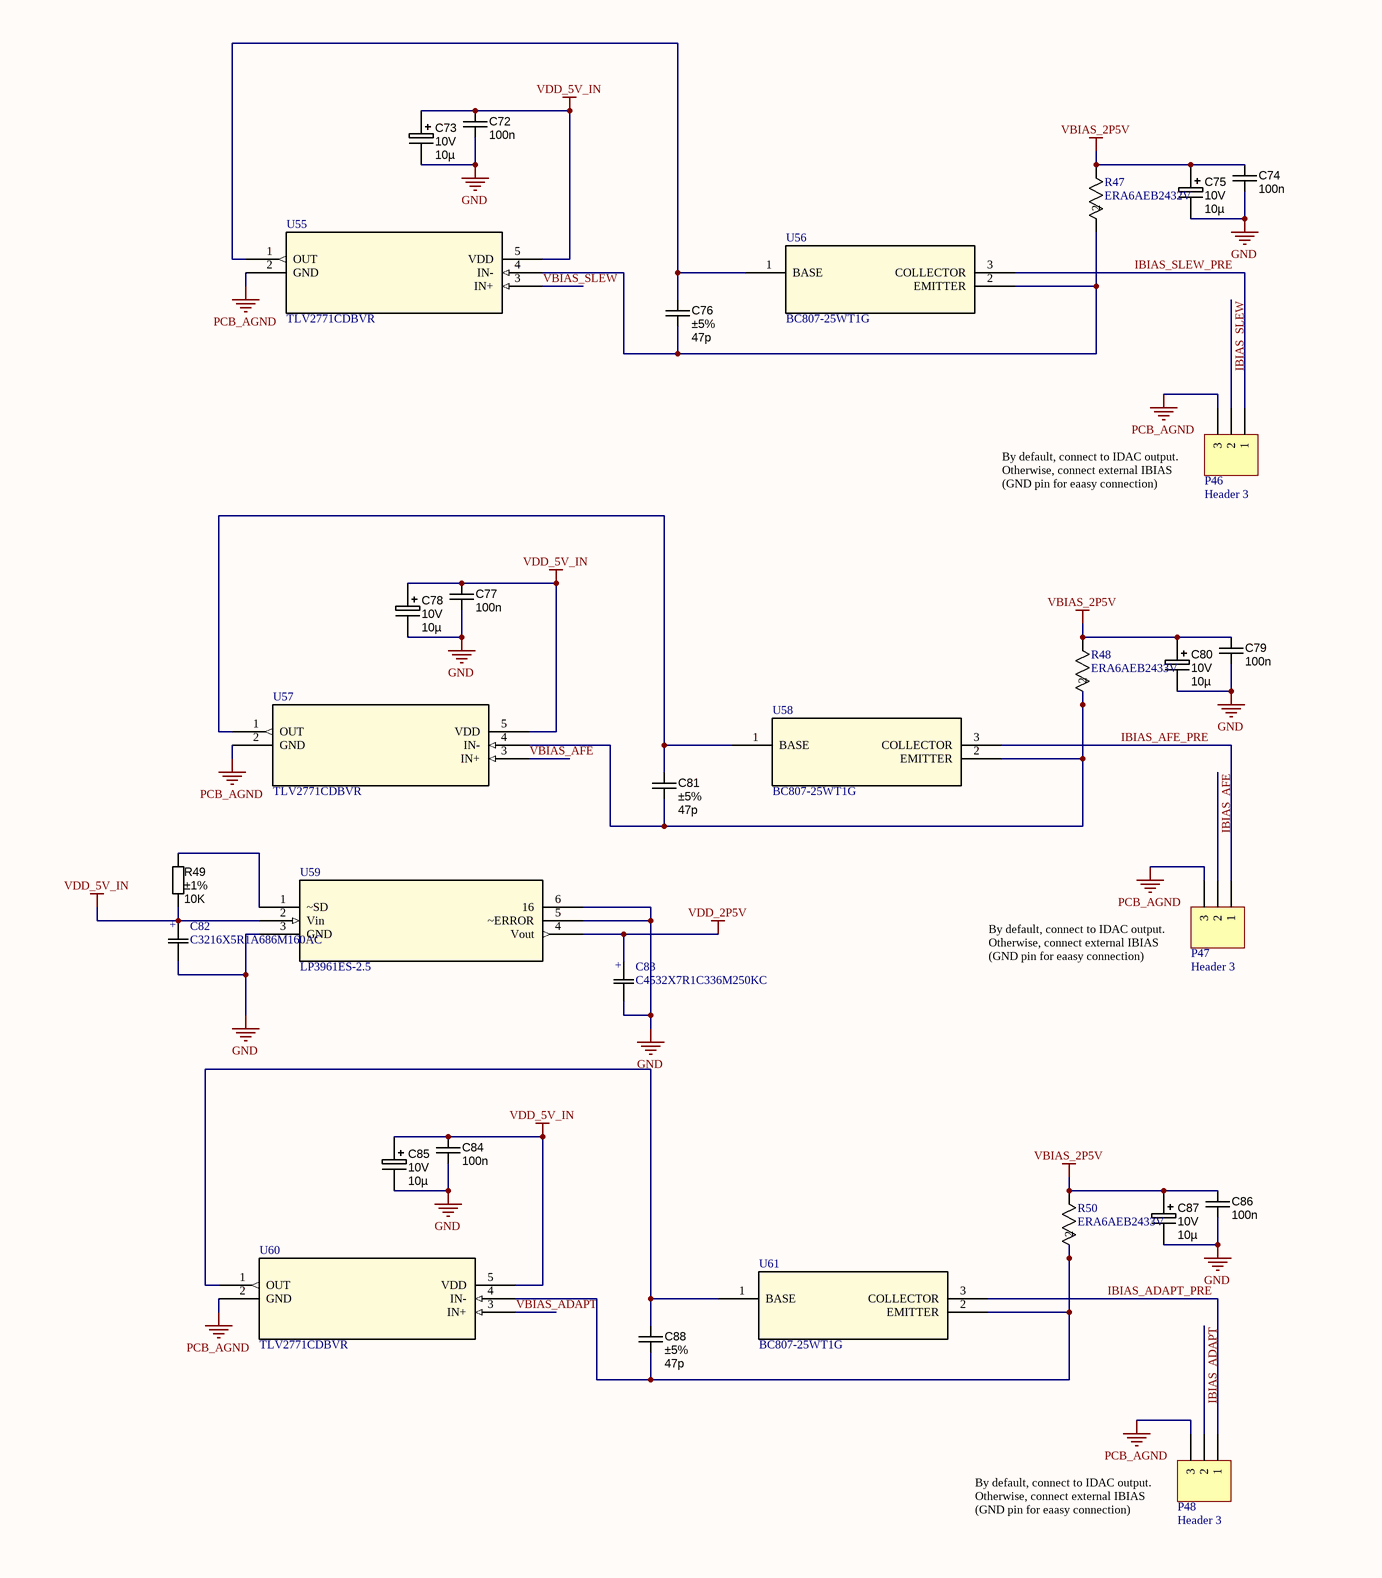
[diagram p11: demo_dermis_main_testboard_ibias.SchDoc, bottom]

### Parts
C64  value 100n  [CAPC1608N]  (hidden comment: approved sub OK)
C65  Ratings: 10V  [CAPMP2012X150USR]  (hidden comment: 10µ)
C66  value 100n  [CAPC1608N]  (hidden comment: approved sub OK)
C67  value 100n  [CAPC1608N]  (hidden comment: approved sub OK)
C68  Ratings: 10V  [CAPMP2012X150USR]  (hidden comment: 10µ)
C69  value 100n  [CAPC1608N]  (hidden comment: approved sub OK)
C70  Ratings: 10V  [CAPMP2012X150USR]  (hidden comment: 10µ)
C71  value 100n  [CAPC1608N]  (hidden comment: approved sub OK)
C72  value 100n  [CAPC1608N]  (hidden comment: approved sub OK)
C73  Ratings: 10V  [CAPMP2012X150USR]  (hidden comment: 10µ)
C74  value 100n  [CAPC1608N]  (hidden comment: approved sub OK)
C75  Ratings: 10V  [CAPMP2012X150USR]  (hidden comment: 10µ)
C76  Tolerance: ±5%  [CAPC1608N]  (hidden comment: 47p)
C77  value 100n  [CAPC1608N]  (hidden comment: approved sub OK)
C78  Ratings: 10V  [CAPMP2012X150USR]  (hidden comment: 10µ)
C79  value 100n  [CAPC1608N]  (hidden comment: approved sub OK)
C80  Ratings: 10V  [CAPMP2012X150USR]  (hidden comment: 10µ)
C81  Tolerance: ±5%  [CAPC1608N]  (hidden comment: 47p)
C82  C3216X5R1A686M160AC  [CAP_3216_TDK]
C83  C4532X7R1C336M250KC  [CAP_4532_TDK]
C84  value 100n  [CAPC1608N]  (hidden comment: approved sub OK)
C85  Ratings: 10V  [CAPMP2012X150USR]  (hidden comment: 10µ)
C86  value 100n  [CAPC1608N]  (hidden comment: approved sub OK)
C87  Ratings: 10V  [CAPMP2012X150USR]  (hidden comment: 10µ)
C88  Tolerance: ±5%  [CAPC1608N]  (hidden comment: 47p)
C127  value 100n  [CAPC1608N]  (hidden comment: approved sub OK)
C128  Ratings: 10V  [CAPMP2012X150USR]  (hidden comment: 10µ)
C129  value 100n  [CAPC1608N]  (hidden comment: approved sub OK)
C130  Ratings: 10V  [CAPMP2012X150USR]  (hidden comment: 10µ)
C131  Ratings: 10V  [CAPMP2012X150USR]  (hidden comment: 10µ)
C132  Ratings: 10V  [CAPMP2012X150USR]  (hidden comment: 10µ)
C133  Ratings: 10V  [CAPMP2012X150USR]  (hidden comment: 10µ)
J20  901200761  [CONN_90120-0761_MOL]
P44  Header 4X2  [HDR2X4]
P45  Header 3  [HDR1X3]
P46  Header 3  [HDR1X3]
P47  Header 3  [HDR1X3]
P48  Header 3  [HDR1X3]
P72  Header 4X2  [HDR2X4]
P74  Header 2  [HDR1X2]
P75  Header 2  [HDR1X2]
R47  ERA6AEB2432V  [RES_ERA6A_0805_PAN]
R48  ERA6AEB2433V  [RES_ERA6A_0805_PAN]
R49  value 10K  Tolerance: ±1%  [RESC1608N]  (hidden comment: Thick Film)
R50  ERA6AEB2433V  [RES_ERA6A_0805_PAN]
R78  RNCF0603TKY10K0  [STA_RNCF0603_STP]
R79  RNCF0603TKY10K0  [STA_RNCF0603_STP]
R80  RNCF0603TKY10K0  [STA_RNCF0603_STP]
R81  RNCF0603TKY10K0  [STA_RNCF0603_STP]
U52  DAC7614EB  [DB20]
U53  ISL60002BIH325Z-T7A  [P3_064_INR]
U54  DAC7614EB  [DB20]
U55  TLV2771CDBVR  [DBV5]
U56  BC807-25WT1G  [SOT-323-3_2P2X1P35_ONS]
U57  TLV2771CDBVR  [DBV5]
U58  BC807-25WT1G  [SOT-323-3_2P2X1P35_ONS]
U59  LP3961ES-2.5  [TS5B_TEX]
U60  TLV2771CDBVR  [DBV5]
U61  BC807-25WT1G  [SOT-323-3_2P2X1P35_ONS]
U69  DAC7614EB  [DB20]

### Nets
GND: C64.2 C65.2 C66.2 C67.2 C68.2 C69.2 C70.2 C71.2 C72.2 C73.2 C74.2 C75.2 C77.2 C78.2 C79.2 C80.2 C82.2 C83.2 C84.2 C85.2 C86.2 C87.2 C127.2 C128.2 C129.2 U52.11(GND) U52.20(RESETSEL) U54.11(GND) U54.20(RESETSEL) U59.3(GND) U59.5(~ERROR) U59.6(16) U69.11(GND) U69.20(RESETSEL)
PCB_AGND: C130.2 C131.2 C132.2 C133.2 J20.1 P44.2 P44.4 P44.6 P44.8 P46.3 P47.3 P48.3 P72.2 P72.4 P72.6 P72.8 U52.4(VREFL) U52.10(VSS) U53.3(GND) U54.4(VREFL) U54.10(VSS) U55.2(GND) U57.2(GND) U60.2(GND) U69.4(VREFL) U69.10(VSS)
VBIAS_2P5V: C66.1 C71.1 C74.1 C75.1 C79.1 C80.1 C86.1 C87.1 C129.1 P45.2 R47.1 R48.1 R50.1 U52.7(VREFH) U54.7(VREFH) U69.7(VREFH)
VDD_2P5V: C83.1 P45.1 U59.4(Vout)
VDD_5V_IN: C64.1 C65.1 C67.1 C68.1 C69.1 C70.1 C72.1 C73.1 C77.1 C78.1 C82.1 C84.1 C85.1 C127.1 C128.1 R49.2 U52.1(VDD) U53.1(VIN) U54.1(VDD) U55.5(VDD) U57.5(VDD) U59.2(Vin) U60.5(VDD) U69.1(VDD)
CSb_IDAC: U54.14(*CS)
CSb_VDAC: U52.14(*CS)
CSb_VDAC_COMP: U69.14(*CS)
IBIAS_ADAPT: P48.2
IBIAS_ADAPT_PRE: P48.1 U61.3(COLLECTOR)
IBIAS_AFE: P47.2
IBIAS_AFE_PRE: P47.1 U58.3(COLLECTOR)
IBIAS_SLEW: P46.2
IBIAS_SLEW_PRE: P46.1 U56.3(COLLECTOR)
LDACb: U52.18(*LOADDACS) U54.18(*LOADDACS) U69.18(*LOADDACS)
RESETb: U52.19(*RESET) U54.19(*RESET) U69.19(*RESET)
SCLK: U52.13(CLK) U54.13(CLK) U69.13(CLK)
SDI: U52.12(SDI) U54.12(SDI) U69.12(SDI)
VBIAS_ADAPT: U54.2(VOUTD) U60.3(IN+)
VBIAS_AFE: U54.8(VOUTB) U57.3(IN+)
VBIAS_SLEW: U54.9(VOUTA) U55.3(IN+)
VCM: P44.1 U52.9(VOUTA)
VCM_COMP: U54.3(VOUTC)
VCM_INAMP: P72.1 U69.9(VOUTA)
VDAC_RESERVED0: P44.7 U52.2(VOUTD)
VDAC_RESERVED1: P72.3 U69.8(VOUTB)
VINN_COMP: C132.1 P75.1 R80.1
VINN_COMP_PREFILT: P72.5 P75.2 R81.2 U69.3(VOUTC)
VINP_COMP: C130.1 P74.1 R78.1
VINP_COMP_PREFILT: P72.7 P74.2 R79.2 U69.2(VOUTD)
VREF_2P5V: P45.3 U53.2(VOUT)
VTRIG_COMP: P44.5 U52.3(VOUTC)
VTUNE_PSEUDO: P44.3 U52.8(VOUTB)
NetC76_1: C76.1 R47.2 U55.4(IN-) U56.2(EMITTER)
NetC76_2: C76.2 U55.1(OUT) U56.1(BASE)
NetC81_1: C81.1 R48.2 U57.4(IN-) U58.2(EMITTER)
NetC81_2: C81.2 U57.1(OUT) U58.1(BASE)
NetC88_1: C88.1 R50.2 U60.4(IN-) U61.2(EMITTER)
NetC88_2: C88.2 U60.1(OUT) U61.1(BASE)
NetC131_1: C131.1 R78.2 R79.1
NetC133_1: C133.1 R80.2 R81.1
NetR49_1: R49.1 U59.1(~SD)

Not connected (* = marked no-connect by the designer): U52 5(NIC) 6(NIC) 15(NIC) 16(NIC) 17(NIC); U54 5(NIC) 6(NIC) 15(NIC) 16(NIC) 17(NIC); U69 5(NIC) 6(NIC) 15(NIC) 16(NIC) 17(NIC)

### Notes on the sheet
- By default, connect to VDD_2P5V (proven to work). Option to VREF for better accuracy
- Passive filters for COMP_IN
- (near P46) By default, connect to IDAC output. Otherwise, connect external IBIAS (GND pin for eaasy connection)
- (near P47) By default, connect to IDAC output. Otherwise, connect external IBIAS (GND pin for eaasy connection)
- (near P48) By default, connect to IDAC output. Otherwise, connect external IBIAS (GND pin for eaasy connection)
- (in symbol C3216X5R1A686M160AC) +
- (in symbol C4532X7R1C336M250KC) +

### Library data of the parts
C64 C66 C67 C69 C71 C72 C74 C77 C79 C84 C86 C127 C129 = CAPC_100n_0603: as C1 on sheet demo_dermis_main_testboard_ncd2400; Manufacturer 2: TDK Corporation; Manufacturer Part Number 2: C1608X7R1H104K; Package / Case: 0603 (1608 Metric); Tolerance: ±10%; Supplier 1: Digi-Key; Supplier Part Number 1: 478-5052-1-ND; ComponentLink1URL: http://www.avx.com/docs/Catalogs/cx7r.pdf; ComponentLink1Description: http://www.avx.com/docs/Catalogs/cx7r.pdf; Supplier 2: Digi-Key; Supplier Part Number 2: 445-1314-1-ND; ComponentLink2URL: http://product.tdk.com/capacitor/mlcc/en/documents/mlcc_commercial_general_en.pdf; ComponentLink2Description: http://product.tdk.com/capacitor/mlcc/en/documents/mlcc_commercial_general_en.pdf
C65 C68 C70 C73 C75 C78 C80 C85 C87 C128 C130-C133 = CAPT_10u_0805_10V: as C2 on sheet demo_dermis_main_testboard_ncd2400; Package / Case: 0805 (2012 metric); Tolerance: ±20%; Material: Tantalum; Supplier 1: Digi-Key; Supplier Part Number 1: 478-3281-1-ND; Value: 10µ
C76 C81 C88 = CAPC_47p_0603: Capacitor SMD Cer 47pF 0603; Ratings: 50V; NP0; Operating Temperature: -55°C ~ 125°C; Package / Case: 0603 (1608 Metric); Size / Dimension: 0.063" L x 0.031" W (1.60mm x 0.80mm); Thickness (Max): 0.037" (0.95mm); ComponentLink1URL: http://www.avx.com/docs/Catalogs/ccog.pdf; ComponentLink1Description: http://www.avx.com/docs/Catalogs/ccog.pdf; ComponentLink2URL: http://www.tdk.com/pdf/tight_tol_B11.pdf; ComponentLink2Description: http://www.tdk.com/pdf/tight_tol_B11.pdf; ComponentLink3URL: http://www.kemet.com/datasheets&C0603C221F5GACTU; ComponentLink3Description: http://www.kemet.com/datasheets&C0603C221F5GACTU; Value: 47p
C82 = C3216X5R1A686M160AC: No Description Available; Mfr_Name: TDK; Type: DEV; Copyright: Copyright (C) 2022 Ultra Librarian. All rights reserved.; Manufacturer_Part_Number: C3216X5R1A686M160AC; RefDes: RefDes
C83 = C4532X7R1C336M250KC: No Description Available; Mfr_Name: TDK; Type: DEV; Copyright: Copyright (C) 2022 Ultra Librarian. All rights reserved.; Manufacturer_Part_Number: C4532X7R1C336M250KC; RefDes: RefDes
J20 = 901200761: No Description Available; Mfr_Name: Molex Connector Corporation; Copyright: Copyright (C) 2022 Ultra Librarian. All rights reserved.; Manufacturer_Part_Number: 901200761; RefDes: RefDes; Type: DEV
P44 P72 = Header 4X2: Header, 4-Pin, Dual row; LatestRevisionDate: 17-Jul-2002; LatestRevisionNote: Re-released for DXP Platform.; Publisher: Altium Limited
P45-P48 = Header 3: Header, 3-Pin; LatestRevisionDate: 17-Jul-2002; LatestRevisionNote: Re-released for DXP Platform.; Publisher: Altium Limited
P74 P75 = Header 2: Header, 2-Pin; LatestRevisionDate: 17-Jul-2002; LatestRevisionNote: Re-released for DXP Platform.; Publisher: Altium Limited
R47 = ERA6AEB2432V: No Description Available; Mfr_Name: Panasonic
R48 R50 = ERA6AEB2433V: No Description Available; Mfr_Name: Panasonic
R49 = RES_10K_0603_1%: Resistor SMD chip 10k Ohm 0.1W 1% 0603; Manufacturer 1: Yageo; Manufacturer Part Number 1: RC0603FR-0710KL; Ratings: 1/10W; Package / Case: 0603 (1608 Metric); Supplier 1: Digi-Key; Supplier Part Number 1: 311-10.0KHRCT-ND
R78-R81 = RNCF0603TKY10K0: No Description Available; Mfr_Name: Stackpole International
U52 U54 U69 = DAC7614EB: No Description Available; Mfr_Name: Texas Instruments; Copyright: Copyright (C) 2022 Ultra Librarian. All rights reserved.; Manufacturer_Part_Number: DAC7614EB; RefDes: RefDes; Type: DEV
U53 = ISL60002BIH325Z-T7A: No Description Available; Mfr_Name: Renesas / Intersil; RefDes: RefDes; Type: Type
U55 U57 U60 = TLV2771CDBVR: No Description Available; Mfr_Name: Texas Instruments; Copyright: Copyright (C) 2022 Ultra Librarian. All rights reserved.; Manufacturer_Part_Number: TLV2771CDBVR; RefDes: RefDes; Type: DEV
U56 U58 U61 = BC807-25WT1G: No Description Available; Mfr_Name: onsemi; RefDes: RefDes; Type: Type
U59 = LP3961ES-2.5: No Description Available; Mfr_Name: Texas Instruments; Copyright: Copyright (C) 2022 Ultra Librarian. All rights reserved.; Manufacturer_Part_Number: LP3961ES-2.5; RefDes: RefDes; Type: DEV

## Sheet demo_dermis_main_testboard_inamps.SchDoc
size A0
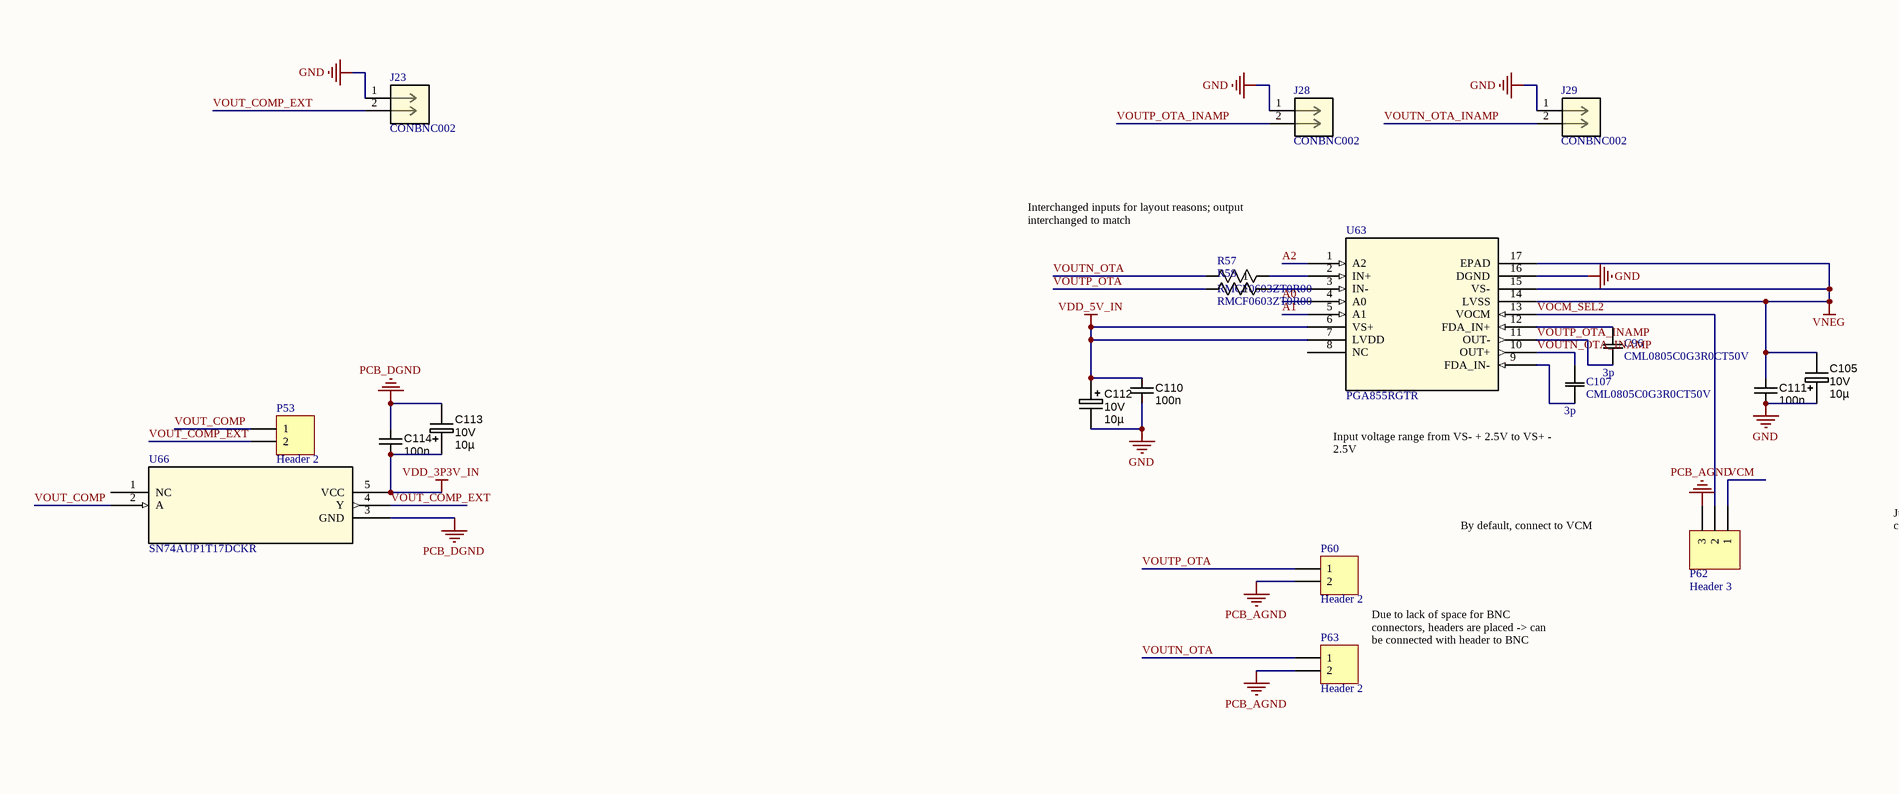
[diagram p12: demo_dermis_main_testboard_inamps.SchDoc, left]
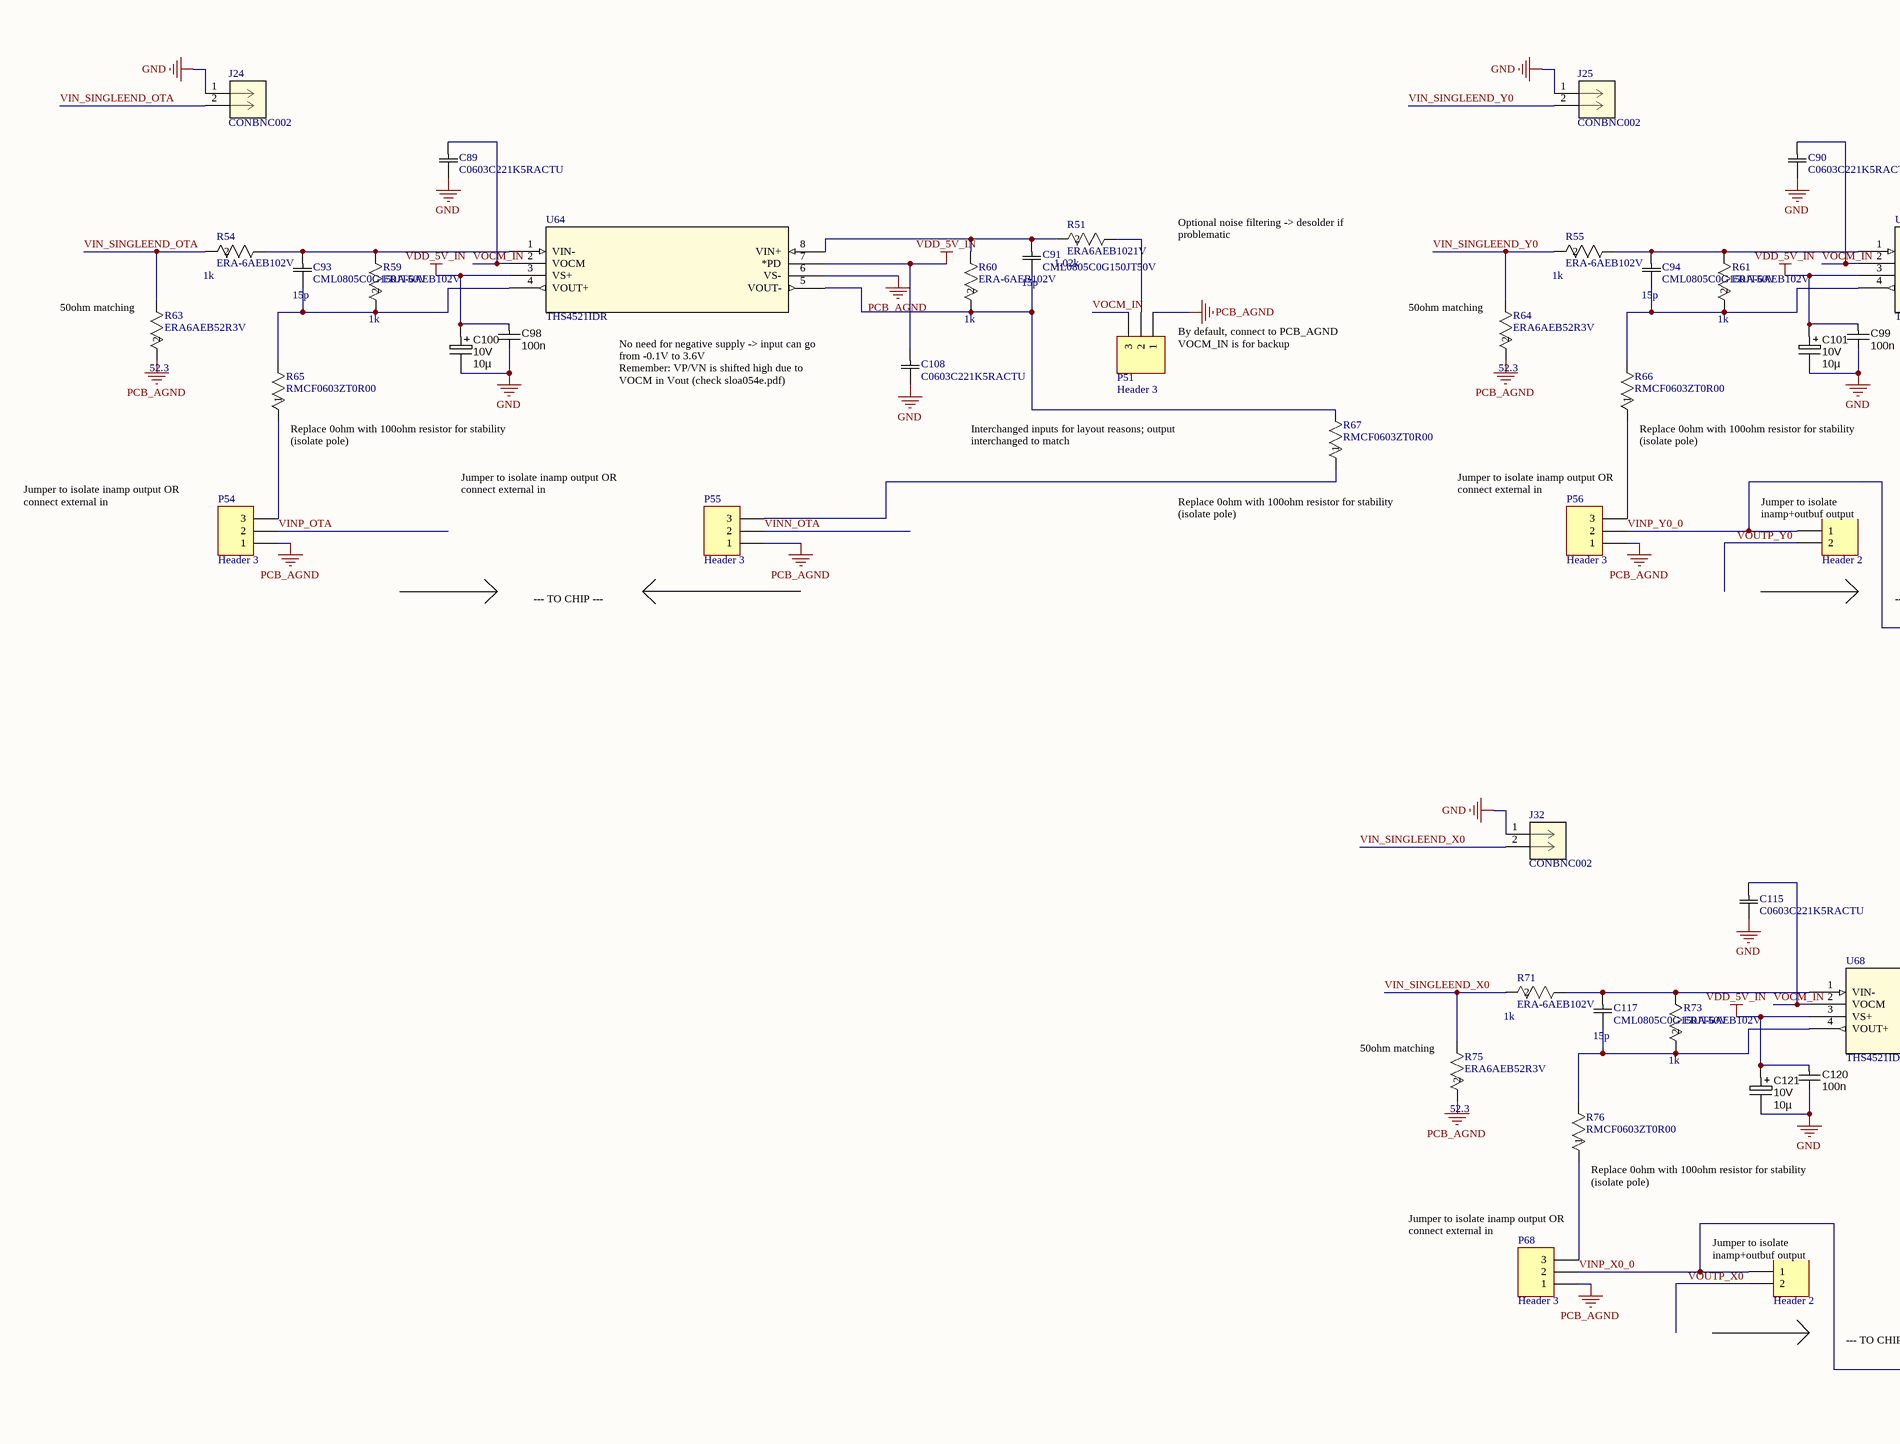
[diagram p13: demo_dermis_main_testboard_inamps.SchDoc, middle]
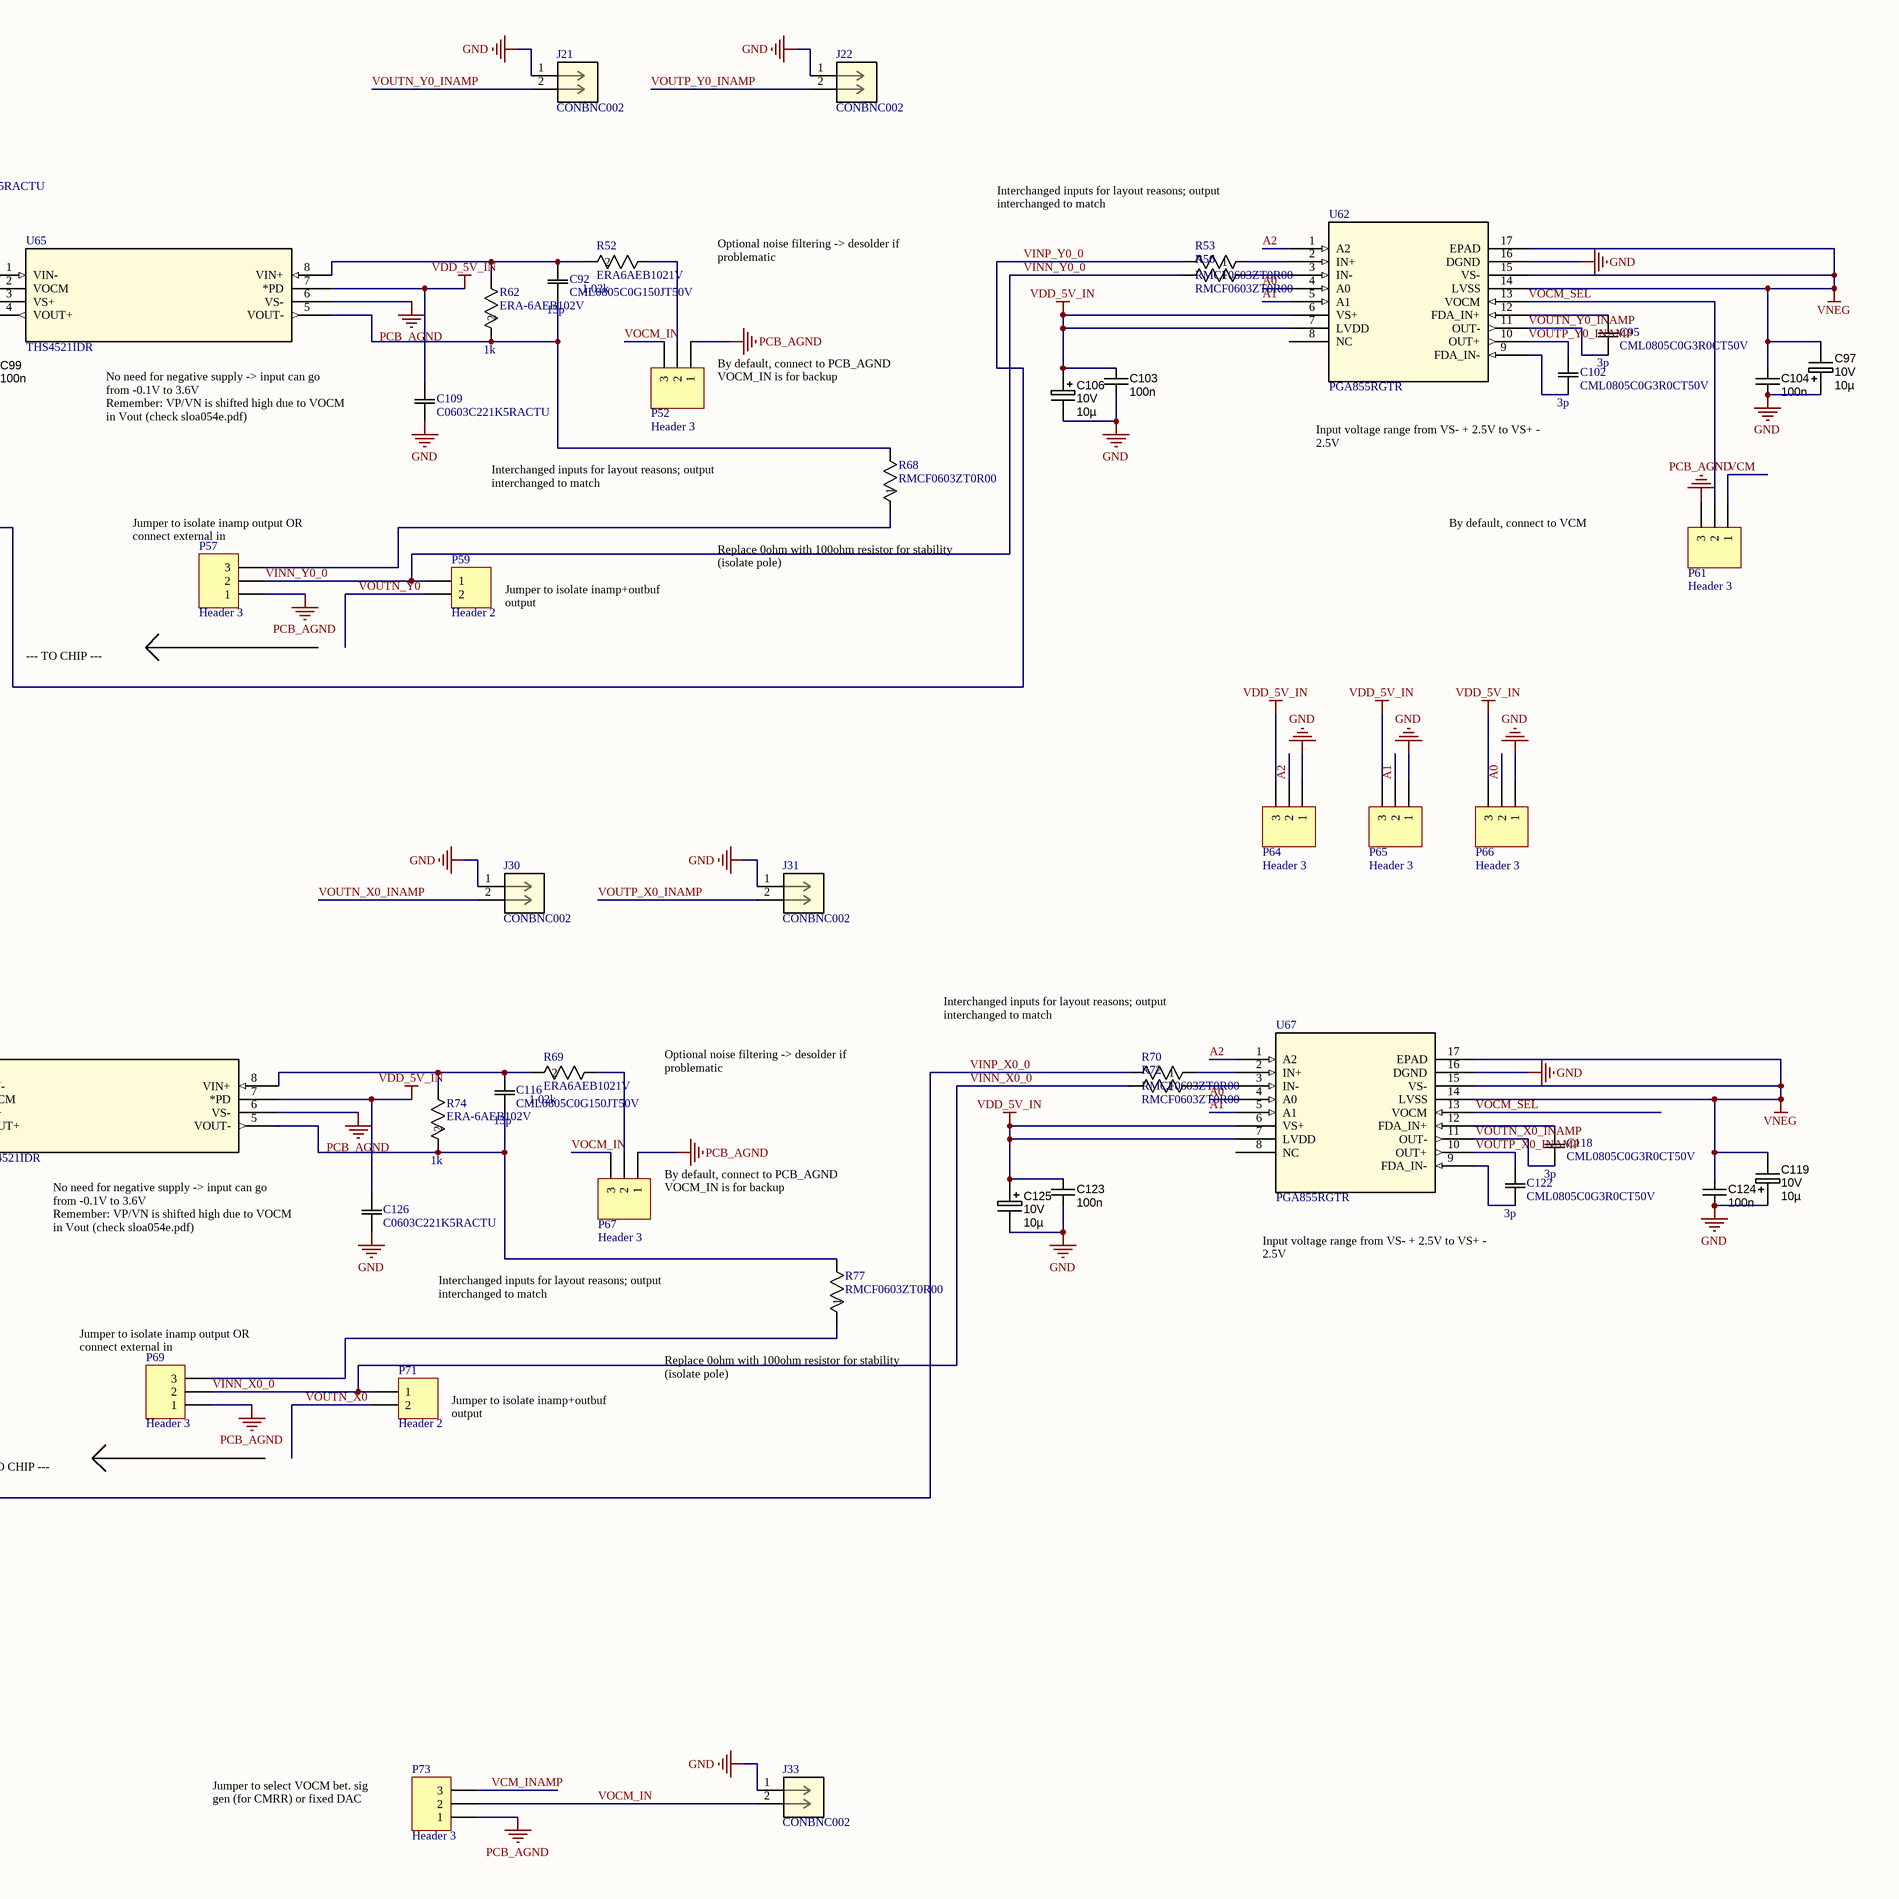
[diagram p14: demo_dermis_main_testboard_inamps.SchDoc, right]

### Parts
C89  C0603C221K5RACTU  [CAPC17595_87N_KEM]
C90  C0603C221K5RACTU  [CAPC17595_87N_KEM]
C91  CML0805C0G150JT50V  value 15p  [CAP_CML_0805_.3pF-1500pF,4700pF_STP]
C92  CML0805C0G150JT50V  value 15p  [CAP_CML_0805_.3pF-1500pF,4700pF_STP]
C93  CML0805C0G150JT50V  value 15p  [CAP_CML_0805_.3pF-1500pF,4700pF_STP]
C94  CML0805C0G150JT50V  value 15p  [CAP_CML_0805_.3pF-1500pF,4700pF_STP]
C95  CML0805C0G3R0CT50V  value 3p  [CAP_CML_0805_.3pF-1500pF,4700pF_STP]
C96  CML0805C0G3R0CT50V  value 3p  [CAP_CML_0805_.3pF-1500pF,4700pF_STP]
C97  Ratings: 10V  [CAPMP2012X150USR]  (hidden comment: 10µ)
C98  value 100n  [CAPC1608N]  (hidden comment: approved sub OK)
C99  value 100n  [CAPC1608N]  (hidden comment: approved sub OK)
C100  Ratings: 10V  [CAPMP2012X150USR]  (hidden comment: 10µ)
C101  Ratings: 10V  [CAPMP2012X150USR]  (hidden comment: 10µ)
C102  CML0805C0G3R0CT50V  value 3p  [CAP_CML_0805_.3pF-1500pF,4700pF_STP]
C103  value 100n  [CAPC1608N]  (hidden comment: approved sub OK)
C104  value 100n  [CAPC1608N]  (hidden comment: approved sub OK)
C105  Ratings: 10V  [CAPMP2012X150USR]  (hidden comment: 10µ)
C106  Ratings: 10V  [CAPMP2012X150USR]  (hidden comment: 10µ)
C107  CML0805C0G3R0CT50V  value 3p  [CAP_CML_0805_.3pF-1500pF,4700pF_STP]
C108  C0603C221K5RACTU  [CAPC17595_87N_KEM]
C109  C0603C221K5RACTU  [CAPC17595_87N_KEM]
C110  value 100n  [CAPC1608N]  (hidden comment: approved sub OK)
C111  value 100n  [CAPC1608N]  (hidden comment: approved sub OK)
C112  Ratings: 10V  [CAPMP2012X150USR]  (hidden comment: 10µ)
C113  Ratings: 10V  [CAPMP2012X150USR]  (hidden comment: 10µ)
C114  value 100n  [CAPC1608N]  (hidden comment: approved sub OK)
C115  C0603C221K5RACTU  [CAPC17595_87N_KEM]
C116  CML0805C0G150JT50V  value 15p  [CAP_CML_0805_.3pF-1500pF,4700pF_STP]
C117  CML0805C0G150JT50V  value 15p  [CAP_CML_0805_.3pF-1500pF,4700pF_STP]
C118  CML0805C0G3R0CT50V  value 3p  [CAP_CML_0805_.3pF-1500pF,4700pF_STP]
C119  Ratings: 10V  [CAPMP2012X150USR]  (hidden comment: 10µ)
C120  value 100n  [CAPC1608N]  (hidden comment: approved sub OK)
C121  Ratings: 10V  [CAPMP2012X150USR]  (hidden comment: 10µ)
C122  CML0805C0G3R0CT50V  value 3p  [CAP_CML_0805_.3pF-1500pF,4700pF_STP]
C123  value 100n  [CAPC1608N]  (hidden comment: approved sub OK)
C124  value 100n  [CAPC1608N]  (hidden comment: approved sub OK)
C125  Ratings: 10V  [CAPMP2012X150USR]  (hidden comment: 10µ)
C126  C0603C221K5RACTU  [CAPC17595_87N_KEM]
J21  CONBNC002  [CONN_CONBN_LNX]
J22  CONBNC002  [CONN_CONBN_LNX]
J23  CONBNC002  [CONN_CONBN_LNX]
J24  CONBNC002  [CONN_CONBN_LNX]
J25  CONBNC002  [CONN_CONBN_LNX]
J28  CONBNC002  [CONN_CONBN_LNX]
J29  CONBNC002  [CONN_CONBN_LNX]
J30  CONBNC002  [CONN_CONBN_LNX]
J31  CONBNC002  [CONN_CONBN_LNX]
J32  CONBNC002  [CONN_CONBN_LNX]
J33  CONBNC002  [CONN_CONBN_LNX]
P51  Header 3  [HDR1X3]
P52  Header 3  [HDR1X3]
P53  Header 2  [HDR1X2]
P54  Header 3  [HDR1X3]
P55  Header 3  [HDR1X3]
P56  Header 3  [HDR1X3]
P57  Header 3  [HDR1X3]
P58  Header 2  [HDR1X2]
P59  Header 2  [HDR1X2]
P60  Header 2  [HDR1X2]
P61  Header 3  [HDR1X3]
P62  Header 3  [HDR1X3]
P63  Header 2  [HDR1X2]
P64  Header 3  [HDR1X3]
P65  Header 3  [HDR1X3]
P66  Header 3  [HDR1X3]
P67  Header 3  [HDR1X3]
P68  Header 3  [HDR1X3]
P69  Header 3  [HDR1X3]
P70  Header 2  [HDR1X2]
P71  Header 2  [HDR1X2]
P73  Header 3  [HDR1X3]
R51  ERA6AEB1021V  value 1.02k  [RES_ERA6A_0805_PAN]
R52  ERA6AEB1021V  value 1.02k  [RES_ERA6A_0805_PAN]
R53  RMCF0603ZT0R00  [STA_RMCF0603_STP]
R54  ERA-6AEB102V  value 1k  [RC0805N_PAN]
R55  ERA-6AEB102V  value 1k  [RC0805N_PAN]
R56  RMCF0603ZT0R00  [STA_RMCF0603_STP]
R57  RMCF0603ZT0R00  [STA_RMCF0603_STP]
R58  RMCF0603ZT0R00  [STA_RMCF0603_STP]
R59  ERA-6AEB102V  value 1k  [RC0805N_PAN]
R60  ERA-6AEB102V  value 1k  [RC0805N_PAN]
R61  ERA-6AEB102V  value 1k  [RC0805N_PAN]
R62  ERA-6AEB102V  value 1k  [RC0805N_PAN]
R63  ERA6AEB52R3V  value 52.3  [RES_ERA6A_0805_PAN]
R64  ERA6AEB52R3V  value 52.3  [RES_ERA6A_0805_PAN]
R65  RMCF0603ZT0R00  [STA_RMCF0603_STP]
R66  RMCF0603ZT0R00  [STA_RMCF0603_STP]
R67  RMCF0603ZT0R00  [STA_RMCF0603_STP]
R68  RMCF0603ZT0R00  [STA_RMCF0603_STP]
R69  ERA6AEB1021V  value 1.02k  [RES_ERA6A_0805_PAN]
R70  RMCF0603ZT0R00  [STA_RMCF0603_STP]
R71  ERA-6AEB102V  value 1k  [RC0805N_PAN]
R72  RMCF0603ZT0R00  [STA_RMCF0603_STP]
R73  ERA-6AEB102V  value 1k  [RC0805N_PAN]
R74  ERA-6AEB102V  value 1k  [RC0805N_PAN]
R75  ERA6AEB52R3V  value 52.3  [RES_ERA6A_0805_PAN]
R76  RMCF0603ZT0R00  [STA_RMCF0603_STP]
R77  RMCF0603ZT0R00  [STA_RMCF0603_STP]
U62  PGA855RGTR  [VQFN16_RGT_TEX]
U63  PGA855RGTR  [VQFN16_RGT_TEX]
U64  THS4521IDR  [D8]
U65  THS4521IDR  [D8]
U66  SN74AUP1T17DCKR  [DCK5]
U67  PGA855RGTR  [VQFN16_RGT_TEX]
U68  THS4521IDR  [D8]

### Nets
GND: C89.2 C90.2 C97.1 C98.2 C99.2 C100.2 C101.2 C103.2 C104.1 C105.1 C106.2 C108.2 C109.2 C110.2 C111.1 C112.2 C115.2 C119.1 C120.2 C121.2 C123.2 C124.1 C125.2 C126.2 J21.1 J22.1 J23.1 J24.1 J25.1 J28.1 J29.1 J30.1 J31.1 J32.1 J33.1 P64.1 P65.1 P66.1 U62.16(DGND) U63.16(DGND) U67.16(DGND)
PCB_AGND: P51.1 P52.1 P54.1 P55.1 P56.1 P57.1 P60.2 P61.3 P62.3 P63.2 P67.1 P68.1 P69.1 P73.1 R63.2 R64.2 R75.2 U64.6(VS-) U65.6(VS-) U68.6(VS-)
PCB_DGND: C113.2 C114.2 U66.3(GND)
VDD_3P3V_IN: C113.1 C114.1 U66.5(VCC)
VDD_5V_IN: C98.1 C99.1 C100.1 C101.1 C103.1 C106.1 C108.1 C109.1 C110.1 C112.1 C120.1 C121.1 C123.1 C125.1 C126.1 P64.3 P65.3 P66.3 U62.6(VS+) U62.7(LVDD) U63.6(VS+) U63.7(LVDD) U64.3(VS+) U64.7(*PD) U65.3(VS+) U65.7(*PD) U67.6(VS+) U67.7(LVDD) U68.3(VS+) U68.7(*PD)
VNEG: C97.2 C104.2 C105.2 C111.2 C119.2 C124.2 U62.14(LVSS) U62.15(VS-) U62.17(EPAD) U63.14(LVSS) U63.15(VS-) U63.17(EPAD) U67.14(LVSS) U67.15(VS-) U67.17(EPAD)
A0: P66.2 U62.4(A0) U63.4(A0) U67.4(A0)
A1: P65.2 U62.5(A1) U63.5(A1) U67.5(A1)
A2: P64.2 U62.1(A2) U63.1(A2) U67.1(A2)
VCM: P61.1 P62.1
VCM_INAMP: P73.3
VIN_SINGLEEND_OTA: J24.2 R54.2 R63.1
VIN_SINGLEEND_X0: J32.2 R71.2 R75.1
VIN_SINGLEEND_Y0: J25.2 R55.2 R64.1
VINN_OTA: P55.2
VINN_X0_0: P69.2 P71.1 R72.2
VINN_Y0_0: P57.2 P59.1 R56.2
VINP_OTA: P54.2
VINP_X0_0: P68.2 P70.1 R70.2
VINP_Y0_0: P56.2 P58.1 R53.2
VOCM_IN: C89.1 C90.1 C115.1 J33.2 P51.3 P52.3 P67.3 P73.2 U64.2(VOCM) U65.2(VOCM) U68.2(VOCM)
VOCM_SEL: P61.2 U62.13(VOCM) U67.13(VOCM)
VOCM_SEL2: P62.2 U63.13(VOCM)
VOUT_COMP: P53.1 U66.2(A)
VOUT_COMP_EXT: J23.2 P53.2 U66.4(Y)
VOUTN_OTA: P63.1 R57.2
VOUTN_OTA_INAMP: C107.2 J29.2 U63.10(OUT+)
VOUTN_X0: P71.2
VOUTN_X0_INAMP: C118.1 J30.2 U67.11(OUT-)
VOUTN_Y0: P59.2
VOUTN_Y0_INAMP: C95.1 J21.2 U62.11(OUT-)
VOUTP_OTA: P60.1 R58.2
VOUTP_OTA_INAMP: C96.1 J28.2 U63.11(OUT-)
VOUTP_X0: P70.2
VOUTP_X0_INAMP: C122.2 J31.2 U67.10(OUT+)
VOUTP_Y0: P58.2
VOUTP_Y0_INAMP: C102.2 J22.2 U62.10(OUT+)
NetC91_1: C91.1 R51.2 R60.1 U64.8(VIN+)
NetC91_2: C91.2 R60.2 R67.2 U64.5(VOUT-)
NetC92_1: C92.1 R52.2 R62.1 U65.8(VIN+)
NetC92_2: C92.2 R62.2 R68.2 U65.5(VOUT-)
NetC93_1: C93.1 R54.1 R59.1 U64.1(VIN-)
NetC93_2: C93.2 R59.2 R65.2 U64.4(VOUT+)
NetC94_1: C94.1 R55.1 R61.1 U65.1(VIN-)
NetC94_2: C94.2 R61.2 R66.2 U65.4(VOUT+)
NetC95_2: C95.2 U62.12(FDA_IN+)
NetC96_2: C96.2 U63.12(FDA_IN+)
NetC102_1: C102.1 U62.9(FDA_IN-)
NetC107_1: C107.1 U63.9(FDA_IN-)
NetC116_1: C116.1 R69.2 R74.1 U68.8(VIN+)
NetC116_2: C116.2 R74.2 R77.2 U68.5(VOUT-)
NetC117_1: C117.1 R71.1 R73.1 U68.1(VIN-)
NetC117_2: C117.2 R73.2 R76.2 U68.4(VOUT+)
NetC118_2: C118.2 U67.12(FDA_IN+)
NetC122_1: C122.1 U67.9(FDA_IN-)
NetP51_2: P51.2 R51.1
NetP52_2: P52.2 R52.1
NetP54_3: P54.3 R65.1
NetP55_3: P55.3 R67.1
NetP56_3: P56.3 R66.1
NetP57_3: P57.3 R68.1
NetP67_2: P67.2 R69.1
NetP68_3: P68.3 R76.1
NetP69_3: P69.3 R77.1
NetR53_1: R53.1 U62.2(IN+)
NetR56_1: R56.1 U62.3(IN-)
NetR57_1: R57.1 U63.2(IN+)
NetR58_1: R58.1 U63.3(IN-)
NetR70_1: R70.1 U67.2(IN+)
NetR72_1: R72.1 U67.3(IN-)

Not connected (* = marked no-connect by the designer): U62 8(NC); U63 8(NC); U66 1(NC); U67 8(NC)

### Notes on the sheet
- Interchanged inputs for layout reasons; output interchanged to match
- Optional noise filtering -> desolder if problematic
- (near R63) 50ohm matching
- (near R64) 50ohm matching
- No need for negative supply -> input can go from -0.1V to 3.6V
  Remember: VP/VN is shifted high due to VOCM in Vout (check sloa054e.pdf)
- By default, connect to PCB_AGND
  VOCM_IN is for backup
- Input voltage range from VS- + 2.5V to VS+ - 2.5V
- (near R65) Replace 0ohm with 100ohm resistor for stability (isolate pole)
- Jumper to isolate inamp output OR connect external in
- (near P56) Jumper to isolate inamp output OR connect external in
- (near R66) Replace 0ohm with 100ohm resistor for stability (isolate pole)
- (near P57) Jumper to isolate inamp output OR connect external in
- By default, connect to VCM
- (near R67) Replace 0ohm with 100ohm resistor for stability (isolate pole)
- (near P58) Jumper to isolate inamp+outbuf output
- Jumper to isolate inamp+outbuf output
- (near R68) Replace 0ohm with 100ohm resistor for stability (isolate pole)
- Due to lack of space for BNC connectors, headers are placed -> can be connected with header to BNC
- --- TO CHIP ---
- (near R75) 50ohm matching
- (near R76) Replace 0ohm with 100ohm resistor for stability (isolate pole)
- (near P68) Jumper to isolate inamp output OR connect external in
- (near P70) Jumper to isolate inamp+outbuf output
- (near P69) Jumper to isolate inamp output OR connect external in
- (near R77) Replace 0ohm with 100ohm resistor for stability (isolate pole)
- Jumper to select VOCM bet. sig gen (for CMRR) or fixed DAC output (VCM)
- Title
- Size:
- Date:
- File:
- A0
- Number:
- Time:
- Revision:
- Sheet
- of

### Library data of the parts
C89 C90 C108 C109 C115 C126 = C0603C221K5RACTU: No Description Available; Mfr_Name: Kemet
C91-C94 C116 C117 = CML0805C0G150JT50V: No Description Available; Mfr_Name: Stackpole International
C95 C96 C102 C107 C118 C122 = CML0805C0G3R0CT50V: No Description Available; Mfr_Name: Stackpole International
C97 C100 C101 C105 C106 C112 C113 C119 C121 C125 = CAPT_10u_0805_10V: as C2 on sheet demo_dermis_main_testboard_ncd2400; Package / Case: 0805 (2012 metric); Tolerance: ±20%; Material: Tantalum; Supplier 1: Digi-Key; Supplier Part Number 1: 478-3281-1-ND; Value: 10µ
C98 C99 C103 C104 C110 C111 C114 C120 C123 C124 = CAPC_100n_0603: as C1 on sheet demo_dermis_main_testboard_ncd2400; Manufacturer 2: TDK Corporation; Manufacturer Part Number 2: C1608X7R1H104K; Package / Case: 0603 (1608 Metric); Tolerance: ±10%; Supplier 1: Digi-Key; Supplier Part Number 1: 478-5052-1-ND; ComponentLink1URL: http://www.avx.com/docs/Catalogs/cx7r.pdf; ComponentLink1Description: http://www.avx.com/docs/Catalogs/cx7r.pdf; Supplier 2: Digi-Key; Supplier Part Number 2: 445-1314-1-ND; ComponentLink2URL: http://product.tdk.com/capacitor/mlcc/en/documents/mlcc_commercial_general_en.pdf; ComponentLink2Description: http://product.tdk.com/capacitor/mlcc/en/documents/mlcc_commercial_general_en.pdf
J21-J25 J28-J33 = CONBNC002: No Description Available; Mfr_Name: Linx Technologies; RefDes: RefDes; Type: Type
P51 P52 P54-P57 P61 P62 P64-P69 P73 = Header 3: Header, 3-Pin; LatestRevisionDate: 17-Jul-2002; LatestRevisionNote: Re-released for DXP Platform.; Publisher: Altium Limited
P53 P58-P60 P63 P70 P71 = Header 2: Header, 2-Pin; LatestRevisionDate: 17-Jul-2002; LatestRevisionNote: Re-released for DXP Platform.; Publisher: Altium Limited
R51 R52 R69 = ERA6AEB1021V: No Description Available; Mfr_Name: Panasonic
R53 R56-R58 R65-R68 R70 R72 R76 R77 = RMCF0603ZT0R00: as R6 on sheet demo_dermis_main_testboard_ncd2400
R54 R55 R59-R62 R71 R73 R74 = ERA-6AEB102V: No Description Available; Mfr_Name: Panasonic
R63 R64 R75 = ERA6AEB52R3V: No Description Available; Mfr_Name: Panasonic
U62 U63 U67 = PGA855RGTR: No Description Available; Mfr_Name: Texas Instruments; Type: Linear; RefDes: RefDes
U64 U65 U68 = THS4521IDR: No Description Available; Mfr_Name: Texas Instruments; RefDes: RefDes; Type: Type
U66 = SN74AUP1T17DCKR: No Description Available; Mfr_Name: Texas Instruments; RefDes: RefDes; Type: Type

## Sheet demo_dermis_main_testboard_dig.SchDoc
size A0
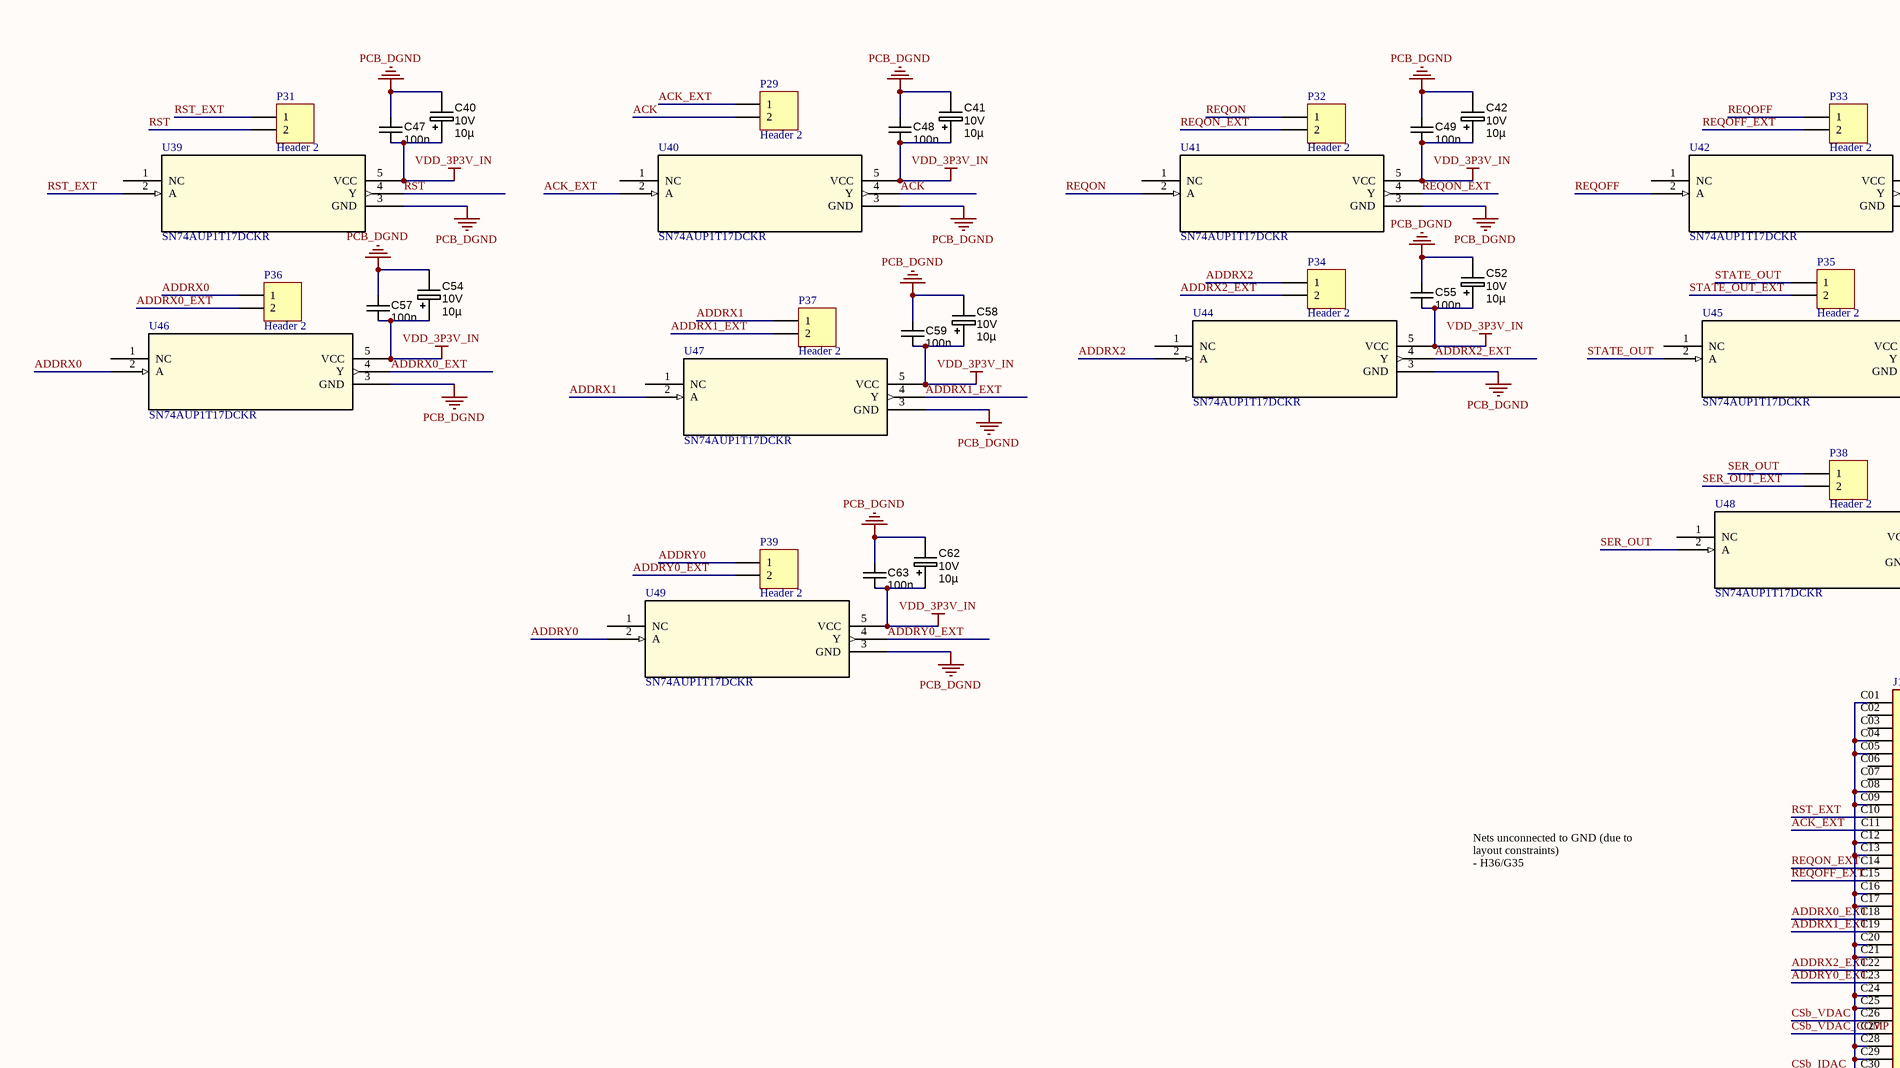
[diagram p15: demo_dermis_main_testboard_dig.SchDoc, top left]
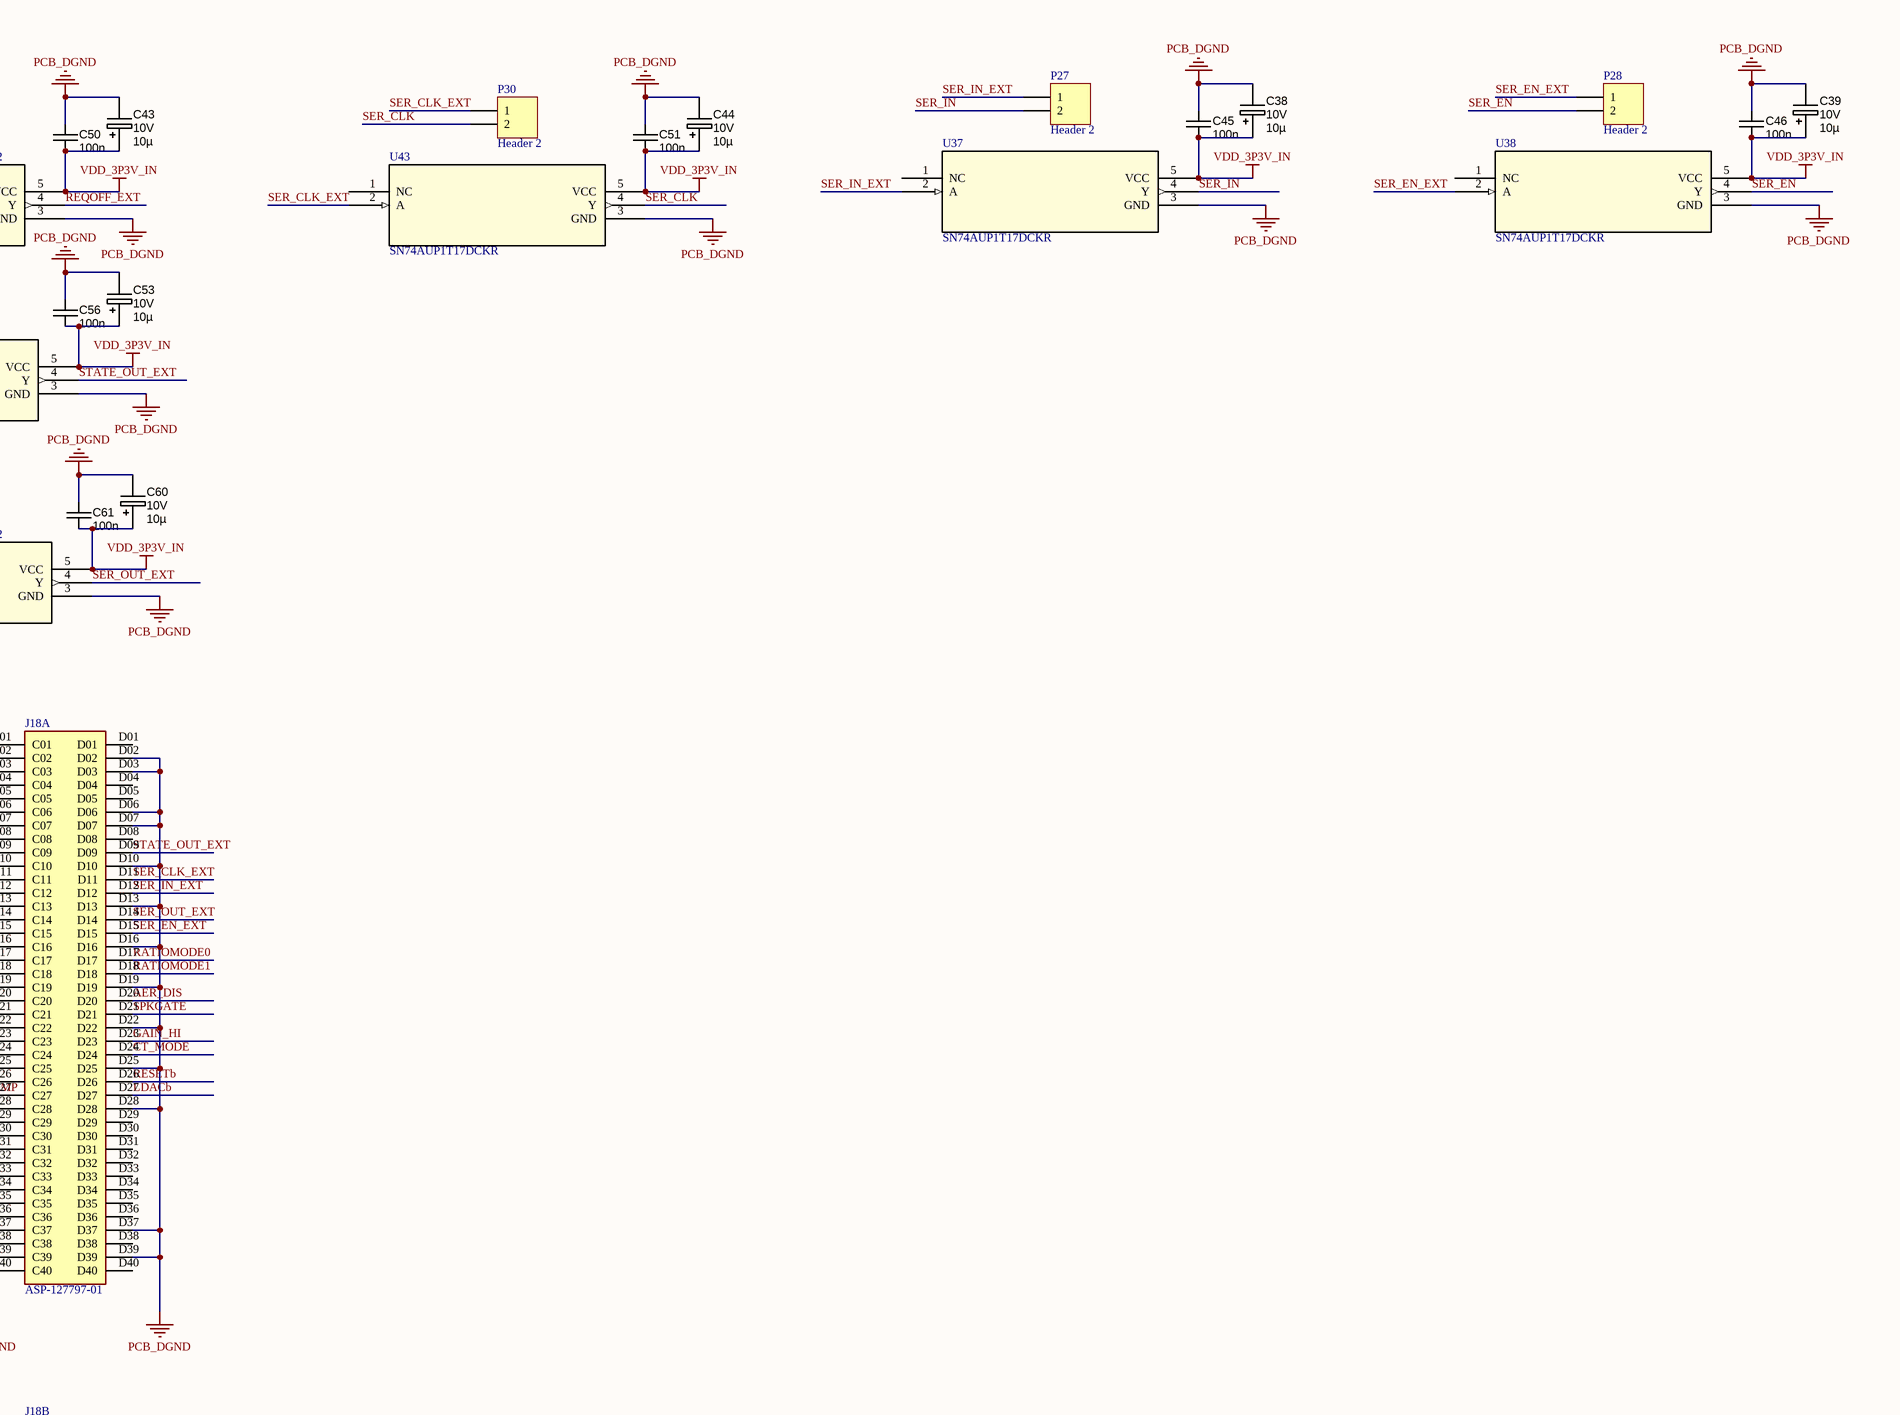
[diagram p16: demo_dermis_main_testboard_dig.SchDoc, top right]
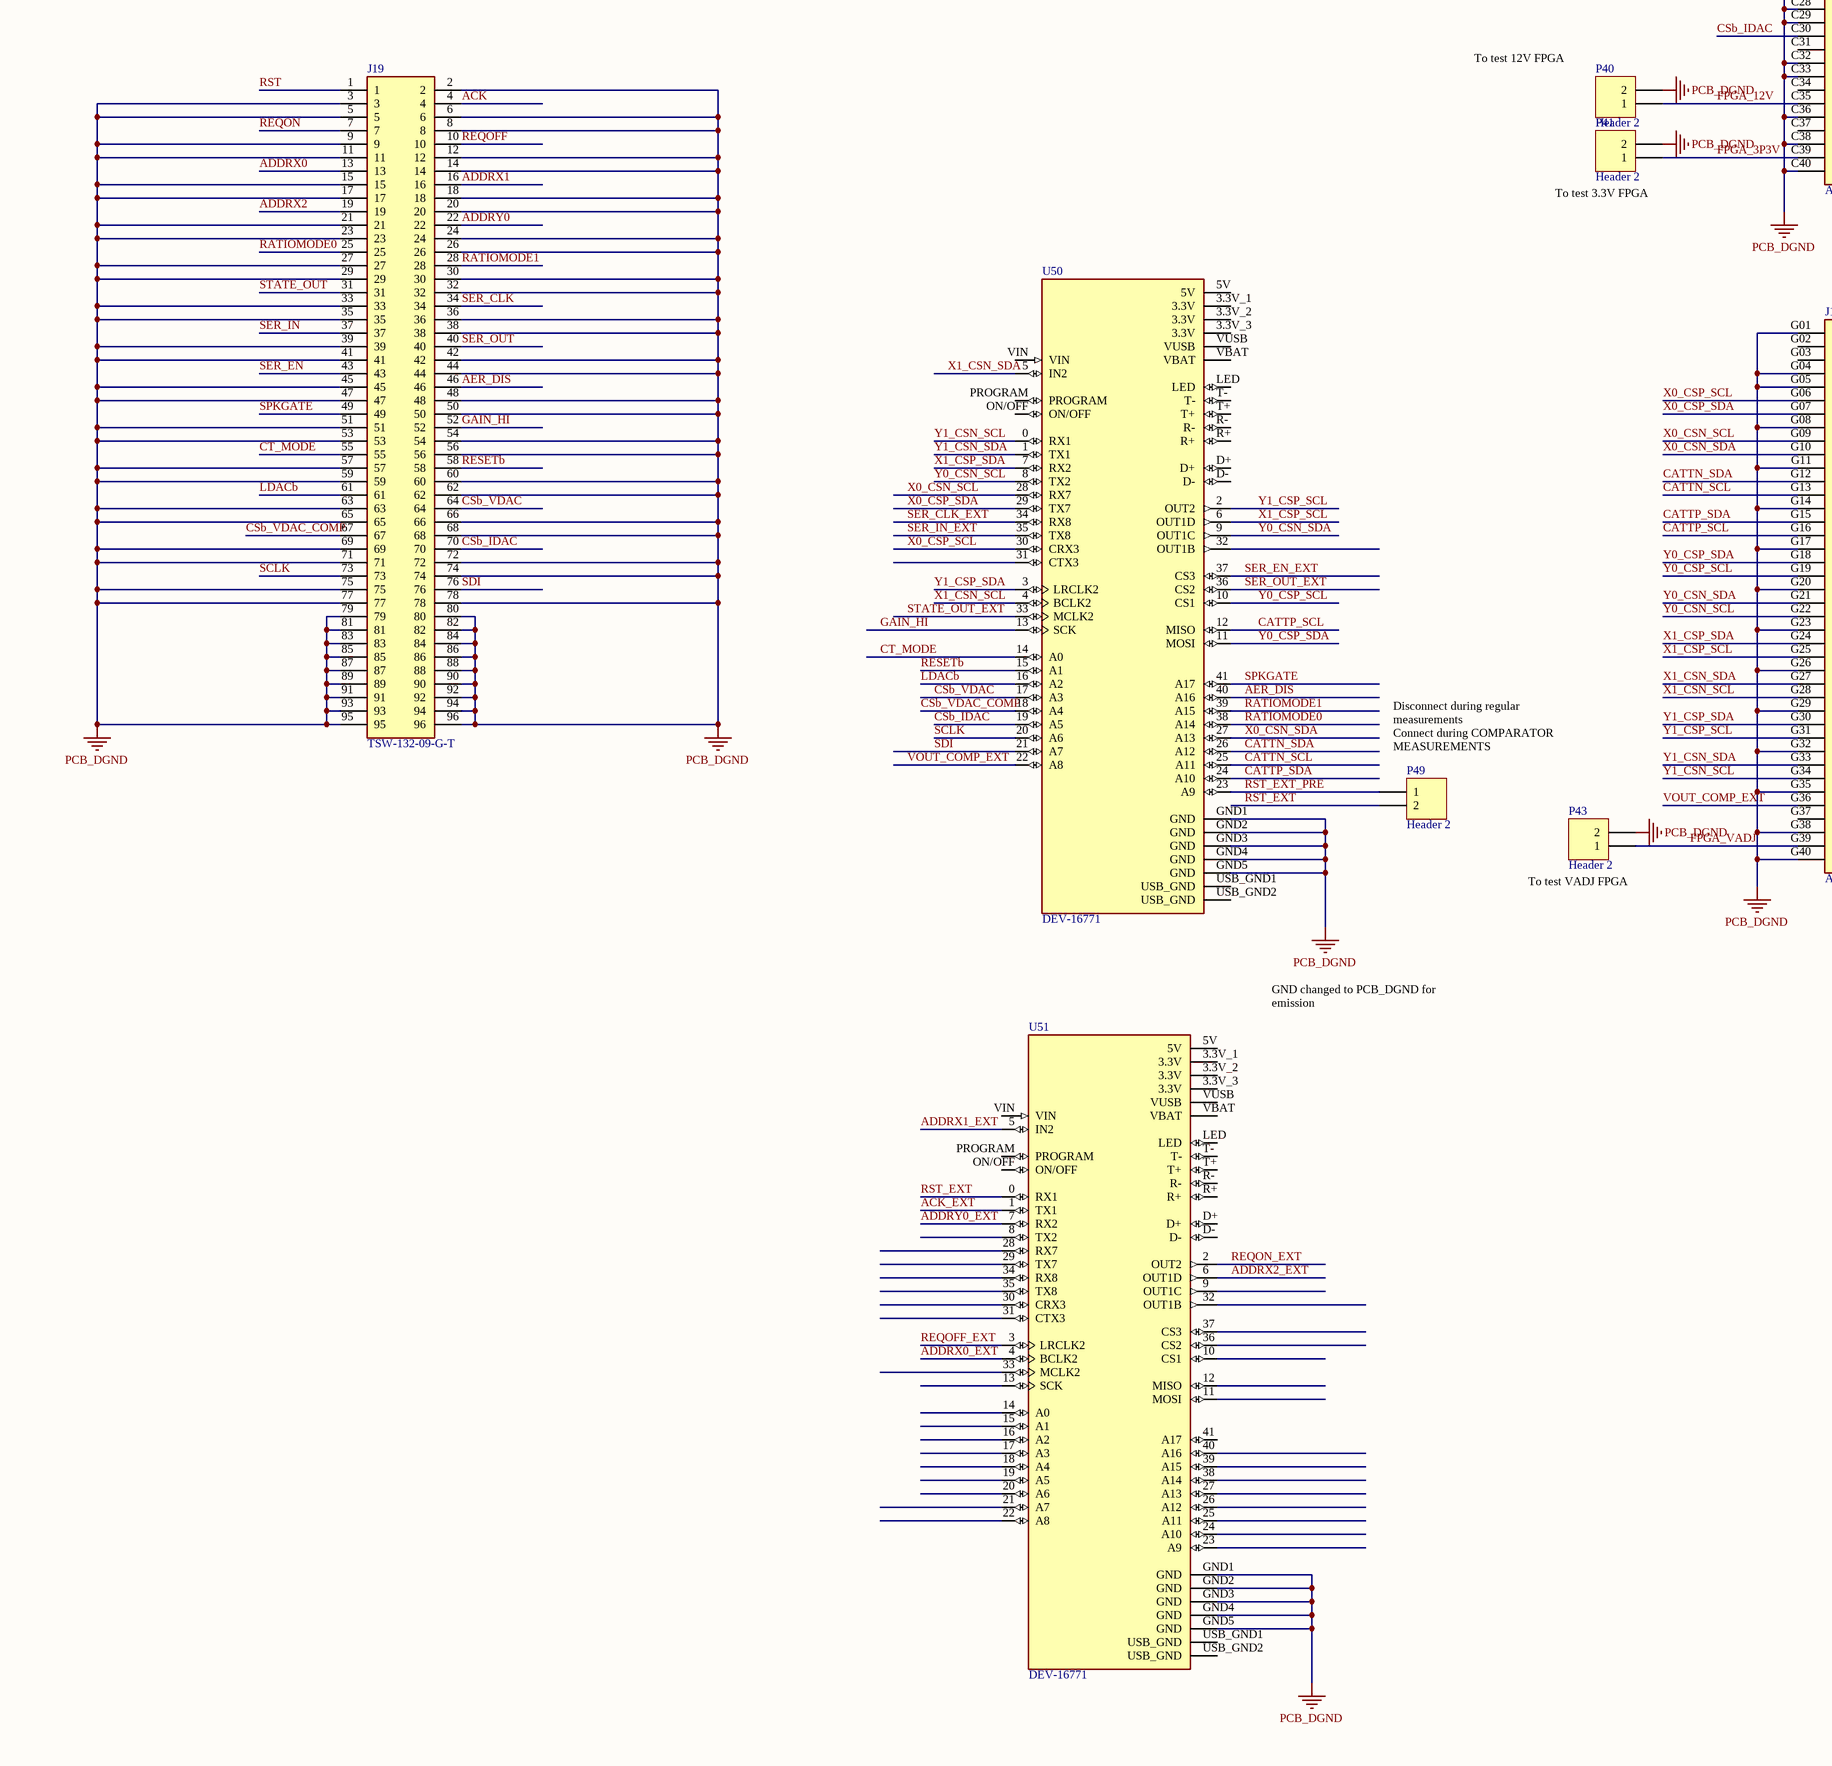
[diagram p17: demo_dermis_main_testboard_dig.SchDoc, bottom left]
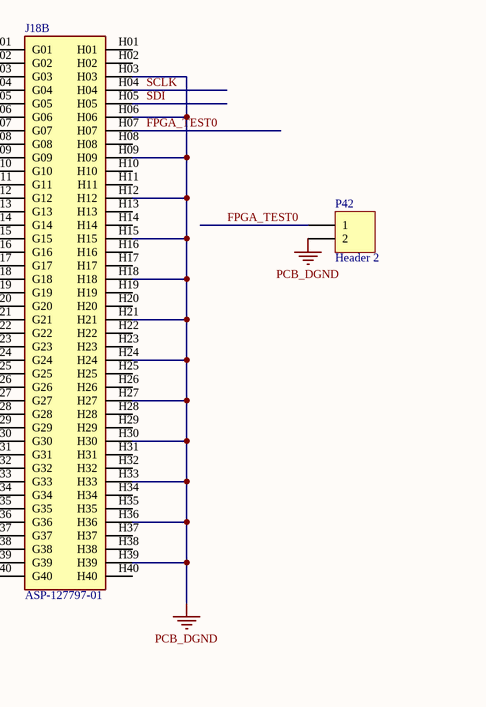
[diagram p18: demo_dermis_main_testboard_dig.SchDoc, bottom right]

### Parts
C38  Ratings: 10V  [CAPMP2012X150USR]  (hidden comment: 10µ)
C39  Ratings: 10V  [CAPMP2012X150USR]  (hidden comment: 10µ)
C40  Ratings: 10V  [CAPMP2012X150USR]  (hidden comment: 10µ)
C41  Ratings: 10V  [CAPMP2012X150USR]  (hidden comment: 10µ)
C42  Ratings: 10V  [CAPMP2012X150USR]  (hidden comment: 10µ)
C43  Ratings: 10V  [CAPMP2012X150USR]  (hidden comment: 10µ)
C44  Ratings: 10V  [CAPMP2012X150USR]  (hidden comment: 10µ)
C45  value 100n  [CAPC1608N]  (hidden comment: approved sub OK)
C46  value 100n  [CAPC1608N]  (hidden comment: approved sub OK)
C47  value 100n  [CAPC1608N]  (hidden comment: approved sub OK)
C48  value 100n  [CAPC1608N]  (hidden comment: approved sub OK)
C49  value 100n  [CAPC1608N]  (hidden comment: approved sub OK)
C50  value 100n  [CAPC1608N]  (hidden comment: approved sub OK)
C51  value 100n  [CAPC1608N]  (hidden comment: approved sub OK)
C52  Ratings: 10V  [CAPMP2012X150USR]  (hidden comment: 10µ)
C53  Ratings: 10V  [CAPMP2012X150USR]  (hidden comment: 10µ)
C54  Ratings: 10V  [CAPMP2012X150USR]  (hidden comment: 10µ)
C55  value 100n  [CAPC1608N]  (hidden comment: approved sub OK)
C56  value 100n  [CAPC1608N]  (hidden comment: approved sub OK)
C57  value 100n  [CAPC1608N]  (hidden comment: approved sub OK)
C58  Ratings: 10V  [CAPMP2012X150USR]  (hidden comment: 10µ)
C59  value 100n  [CAPC1608N]  (hidden comment: approved sub OK)
C60  Ratings: 10V  [CAPMP2012X150USR]  (hidden comment: 10µ)
C61  value 100n  [CAPC1608N]  (hidden comment: approved sub OK)
C62  Ratings: 10V  [CAPMP2012X150USR]  (hidden comment: 10µ)
C63  value 100n  [CAPC1608N]  (hidden comment: approved sub OK)
J18  ASP-127797-01  [SAMTEC_ASP-127797-01]  (parts A,B of 2)
J19  TSW-132-09-G-T  [HDRV96W64P254_3X32_8128X749X838P]
P27  Header 2  [HDR1X2]
P28  Header 2  [HDR1X2]
P29  Header 2  [HDR1X2]
P30  Header 2  [HDR1X2]
P31  Header 2  [HDR1X2]
P32  Header 2  [HDR1X2]
P33  Header 2  [HDR1X2]
P34  Header 2  [HDR1X2]
P35  Header 2  [HDR1X2]
P36  Header 2  [HDR1X2]
P37  Header 2  [HDR1X2]
P38  Header 2  [HDR1X2]
P39  Header 2  [HDR1X2]
P40  Header 2  [HDR1X2]
P41  Header 2  [HDR1X2]
P42  Header 2  [HDR1X2]
P43  Header 2  [HDR1X2]
P49  Header 2  [HDR1X2]
U37  SN74AUP1T17DCKR  [DCK5]
U38  SN74AUP1T17DCKR  [DCK5]
U39  SN74AUP1T17DCKR  [DCK5]
U40  SN74AUP1T17DCKR  [DCK5]
U41  SN74AUP1T17DCKR  [DCK5]
U42  SN74AUP1T17DCKR  [DCK5]
U43  SN74AUP1T17DCKR  [DCK5]
U44  SN74AUP1T17DCKR  [DCK5]
U45  SN74AUP1T17DCKR  [DCK5]
U46  SN74AUP1T17DCKR  [DCK5]
U47  SN74AUP1T17DCKR  [DCK5]
U48  SN74AUP1T17DCKR  [DCK5]
U49  SN74AUP1T17DCKR  [DCK5]
U50  DEV-16771  [MODULE_DEV-16771]
U51  DEV-16771  [MODULE_DEV-16771]

### Nets
PCB_DGND: C38.2 C39.2 C40.2 C41.2 C42.2 C43.2 C44.2 C45.2 C46.2 C47.2 C48.2 C49.2 C50.2 C51.2 C52.2 C53.2 C54.2 C55.2 C56.2 C57.2 C58.2 C59.2 C60.2 C61.2 C62.2 C63.2 J18.C01 J18.C04 J18.C05 J18.C08 J18.C09 J18.C12 J18.C13 J18.C16 J18.C17 J18.C20 J18.C21 J18.C24 J18.C25 J18.C28 J18.C29 J18.C32 J18.C33 J18.C36 J18.C38 J18.C40 J18.D02 J18.D03 J18.D06 J18.D07 J18.D10 J18.D13 J18.D16 J18.D19 J18.D22 J18.D25 J18.D28 J18.D37 J18.D39 J18.G01 J18.G04 J18.G05 J18.G08 J18.G11 J18.G14 J18.G17 J18.G20 J18.G23 J18.G26 J18.G29 J18.G32 J18.G35 J18.G38 J18.G40 J18.H03 J18.H06 J18.H09 J18.H12 J18.H15 J18.H18 J18.H21 J18.H24 J18.H27 J18.H30 J18.H33 J18.H36 J18.H39 J19.2 J19.3 J19.5 J19.6 J19.8 J19.9 J19.11 J19.12 J19.14 J19.15 J19.17 J19.18 J19.20 J19.21 J19.23 J19.24 J19.26 J19.27 J19.29 J19.30 J19.32 J19.33 J19.35 J19.36 J19.38 J19.39 J19.41 J19.42 J19.44 J19.45 J19.47 J19.48 J19.50 J19.51 J19.53 J19.54 J19.56 J19.57 J19.59 J19.60 J19.62 J19.63 J19.65 J19.66 J19.68 J19.69 J19.71 J19.72 J19.74 J19.75 J19.77 J19.78 J19.79 J19.80 J19.81 J19.82 J19.83 J19.84 J19.85 J19.86 J19.87 J19.88 J19.89 J19.90 J19.91 J19.92 J19.93 J19.94 J19.95 J19.96 P40.2 P41.2 P42.2 P43.2 U37.3(GND) U38.3(GND) U39.3(GND) U40.3(GND) U41.3(GND) U42.3(GND) U43.3(GND) U44.3(GND) U45.3(GND) U46.3(GND) U47.3(GND) U48.3(GND) U49.3(GND) U50.GND1(GND) U50.GND2(GND) U50.GND3(GND) U50.GND4(GND) U50.GND5(GND) U51.GND1(GND) U51.GND2(GND) U51.GND3(GND) U51.GND4(GND) U51.GND5(GND)
VDD_3P3V_IN: C38.1 C39.1 C40.1 C41.1 C42.1 C43.1 C44.1 C45.1 C46.1 C47.1 C48.1 C49.1 C50.1 C51.1 C52.1 C53.1 C54.1 C55.1 C56.1 C57.1 C58.1 C59.1 C60.1 C61.1 C62.1 C63.1 U37.5(VCC) U38.5(VCC) U39.5(VCC) U40.5(VCC) U41.5(VCC) U42.5(VCC) U43.5(VCC) U44.5(VCC) U45.5(VCC) U46.5(VCC) U47.5(VCC) U48.5(VCC) U49.5(VCC)
ACK: J19.4 P29.2 U40.4(Y)
ACK_EXT: J18.C11 P29.1 U40.2(A) U51.1(TX1)
ADDRX0: J19.13 P36.1 U46.2(A)
ADDRX0_EXT: J18.C18 P36.2 U46.4(Y) U51.4(BCLK2)
ADDRX1: J19.16 P37.1 U47.2(A)
ADDRX1_EXT: J18.C19 P37.2 U47.4(Y) U51.5(IN2)
ADDRX2: J19.19 P34.1 U44.2(A)
ADDRX2_EXT: J18.C22 P34.2 U44.4(Y) U51.6(OUT1D)
ADDRY0: J19.22 P39.1 U49.2(A)
ADDRY0_EXT: J18.C23 P39.2 U49.4(Y) U51.7(RX2)
AER_DIS: J18.D20 J19.46 U50.40(A16)
CATTN_SCL: J18.G13 U50.25(A11)
CATTN_SDA: J18.G12 U50.26(A12)
CATTP_SCL: J18.G16 U50.12(MISO)
CATTP_SDA: J18.G15 U50.24(A10)
CSb_IDAC: J18.C30 J19.70 U50.19(A5)
CSb_VDAC: J18.C26 J19.64 U50.17(A3)
CSb_VDAC_COMP: J18.C27 J19.67 U50.18(A4)
CT_MODE: J18.D24 J19.55 U50.14(A0)
FPGA_3P3V: J18.C39 P41.1
FPGA_12V: J18.C35 P40.1
FPGA_TEST0: J18.H07 P42.1
FPGA_VADJ: J18.G39 P43.1
GAIN_HI: J18.D23 J19.52 U50.13(SCK)
LDACb: J18.D27 J19.61 U50.16(A2)
RATIOMODE0: J18.D17 J19.25 U50.38(A14)
RATIOMODE1: J18.D18 J19.28 U50.39(A15)
REQOFF: J19.10 P33.1 U42.2(A)
REQOFF_EXT: J18.C15 P33.2 U42.4(Y) U51.3(LRCLK2)
REQON: J19.7 P32.1 U41.2(A)
REQON_EXT: J18.C14 P32.2 U41.4(Y) U51.2(OUT2)
RESETb: J18.D26 J19.58 U50.15(A1)
RST: J19.1 P31.2 U39.4(Y)
RST_EXT: J18.C10 P31.1 P49.2 U39.2(A) U51.0(RX1)
RST_EXT_PRE: P49.1 U50.23(A9)
SCLK: J18.H04 J19.73 U50.20(A6)
SDI: J18.H05 J19.76 U50.21(A7)
SER_CLK: J19.34 P30.2 U43.4(Y)
SER_CLK_EXT: J18.D11 P30.1 U43.2(A) U50.34(RX8)
SER_EN: J19.43 P28.2 U38.4(Y)
SER_EN_EXT: J18.D15 P28.1 U38.2(A) U50.37(CS3)
SER_IN: J19.37 P27.2 U37.4(Y)
SER_IN_EXT: J18.D12 P27.1 U37.2(A) U50.35(TX8)
SER_OUT: J19.40 P38.1 U48.2(A)
SER_OUT_EXT: J18.D14 P38.2 U48.4(Y) U50.36(CS2)
SPKGATE: J18.D21 J19.49 U50.41(A17)
STATE_OUT: J19.31 P35.1 U45.2(A)
STATE_OUT_EXT: J18.D09 P35.2 U45.4(Y) U50.33(MCLK2)
VOUT_COMP_EXT: J18.G36 U50.22(A8)
X0_CSN_SCL: J18.G09 U50.28(RX7)
X0_CSN_SDA: J18.G10 U50.27(A13)
X0_CSP_SCL: J18.G06 U50.30(CRX3)
X0_CSP_SDA: J18.G07 U50.29(TX7)
X1_CSN_SCL: J18.G28 U50.4(BCLK2)
X1_CSN_SDA: J18.G27 U50.5(IN2)
X1_CSP_SCL: J18.G25 U50.6(OUT1D)
X1_CSP_SDA: J18.G24 U50.7(RX2)
Y0_CSN_SCL: J18.G22 U50.8(TX2)
Y0_CSN_SDA: J18.G21 U50.9(OUT1C)
Y0_CSP_SCL: J18.G19 U50.10(CS1)
Y0_CSP_SDA: J18.G18 U50.11(MOSI)
Y1_CSN_SCL: J18.G34 U50.0(RX1)
Y1_CSN_SDA: J18.G33 U50.1(TX1)
Y1_CSP_SCL: J18.G31 U50.2(OUT2)
Y1_CSP_SDA: J18.G30 U50.3(LRCLK2)

Not connected (* = marked no-connect by the designer): J18 C02 C03 C06 C07 C31 C34 C37 D01 D04 D05 D08 D29 D30 D31 D32 D33 D34 D35 D36 D38 D40 G02 G03 G37 H01 H02 H08 H10 H11 H13 H14 H16 H17 H19 H20 H22 H23 H25 H26 H28 H29 H31 H32 H34 H35 H37 H38 H40; U37 1(NC); U38 1(NC); U39 1(NC); U40 1(NC); U41 1(NC); U42 1(NC); U43 1(NC); U44 1(NC); U45 1(NC); U46 1(NC); U47 1(NC); U48 1(NC); U49 1(NC); U50 3.3V_1(3.3V) 3.3V_2(3.3V) 3.3V_3(3.3V) 5V 31(CTX3) 32(OUT1B) D+ D- LED ON/OFF PROGRAM R+ R- T+ T- USB_GND1(USB_GND) USB_GND2(USB_GND) VBAT VIN VUSB; U51 3.3V_1(3.3V) 3.3V_2(3.3V) 3.3V_3(3.3V) 5V 8(TX2) 9(OUT1C) 10(CS1) 11(MOSI) 12(MISO) 13(SCK) 14(A0) 15(A1) 16(A2) 17(A3) 18(A4) 19(A5) 20(A6) 21(A7) 22(A8) 23(A9) 24(A10) 25(A11) 26(A12) 27(A13) 28(RX7) 29(TX7) 30(CRX3) 31(CTX3) 32(OUT1B) 33(MCLK2) 34(RX8) 35(TX8) 36(CS2) 37(CS3) 38(A14) 39(A15) 40(A16) 41(A17) D+ D- LED ON/OFF PROGRAM R+ R- T+ T- USB_GND1(USB_GND) USB_GND2(USB_GND) VBAT VIN VUSB

### Notes on the sheet
- Nets unconnected to GND (due to layout constraints)
  - H36/G35
- To test 12V FPGA
- (near P41) To test 3.3V FPGA
- (near P49) Disconnect during regular measurements
  Connect during COMPARATOR MEASUREMENTS
- (near P43) To test VADJ FPGA
- GND changed to PCB_DGND for emission
- Title
- Size:
- Date:
- File:
- A0
- Number:
- Time:
- Revision:
- Sheet
- of

### Library data of the parts
C38-C44 C52-C54 C58 C60 C62 = CAPT_10u_0805_10V: as C2 on sheet demo_dermis_main_testboard_ncd2400; Package / Case: 0805 (2012 metric); Tolerance: ±20%; Material: Tantalum; Supplier 1: Digi-Key; Supplier Part Number 1: 478-3281-1-ND; Value: 10µ
C45-C51 C55-C57 C59 C61 C63 = CAPC_100n_0603: as C1 on sheet demo_dermis_main_testboard_ncd2400; Manufacturer 2: TDK Corporation; Manufacturer Part Number 2: C1608X7R1H104K; Package / Case: 0603 (1608 Metric); Tolerance: ±10%; Supplier 1: Digi-Key; Supplier Part Number 1: 478-5052-1-ND; ComponentLink1URL: http://www.avx.com/docs/Catalogs/cx7r.pdf; ComponentLink1Description: http://www.avx.com/docs/Catalogs/cx7r.pdf; Supplier 2: Digi-Key; Supplier Part Number 2: 445-1314-1-ND; ComponentLink2URL: http://product.tdk.com/capacitor/mlcc/en/documents/mlcc_commercial_general_en.pdf; ComponentLink2Description: http://product.tdk.com/capacitor/mlcc/en/documents/mlcc_commercial_general_en.pdf
J18 = ASP-127797-01: 160 Position Connector Array, Male Pins Surface Mount Gold; MF: Samtec Inc.; Package: None; Price: None; Check_prices: https://www.snapeda.com/parts/ASP-127797-01/Samtec+Inc./view-part/?ref=eda; Value: *; SnapEDA_Link: https://www.snapeda.com/parts/ASP-127797-01/Samtec+Inc./view-part/?ref=snap; MP: ASP-127797-01; Availability: In Stock; Purchase-URL: https://pricing.snapeda.com/search?q=ASP-127797-01&ref=eda
J19 = TSW-132-09-G-T: CONN HEADER 96 POS .100"; Manufacturer_Name: SAMTEC; Geometry.Height: 8.38mm; Farnell Part Number: *; Farnell Price/Stock: *; Manufacturer_Part_Number: TSW-132-09-G-T; Datasheet Link: http://suddendocs.samtec.com/catalog_english/tsw_th.pdf
P27-P43 P49 = Header 2: Header, 2-Pin; LatestRevisionDate: 17-Jul-2002; LatestRevisionNote: Re-released for DXP Platform.; Publisher: Altium Limited
U37-U49 = SN74AUP1T17DCKR: as U66 on sheet demo_dermis_main_testboard_inamps; RefDes: RefDes; Type: Type
U50 U51 = DEV-16771: RT1062 Teensy 4.1 series ARM® Cortex®-M7 MPU Embedded Evaluation Board; MF: SparkFun Electronics; SnapEDA_Link: https://www.snapeda.com/parts/DEV-16771/SparkFun+Electronics/view-part/?ref=snap; Package: None; Value: *; MP: DEV-16771; Check_prices: https://www.snapeda.com/parts/DEV-16771/SparkFun+Electronics/view-part/?ref=eda